# EasyEDA Pro project ProProject_Robot druha verzia_2024-07-18.epro

# Schematic Schematic1

## Sheets
1 MCU core: Create Date: 2024-06-12; Page Name: MCU core; Project Name: Robot druha verzia; Schematic Name: Schematic1; Update Date: 2024-07-14; Company: EasyEDA.com; Drawn: EasyEDA; Page Size: A4; Part Number: JLCPCB-002; Reviewed: EasyEDA; Version: V0.1
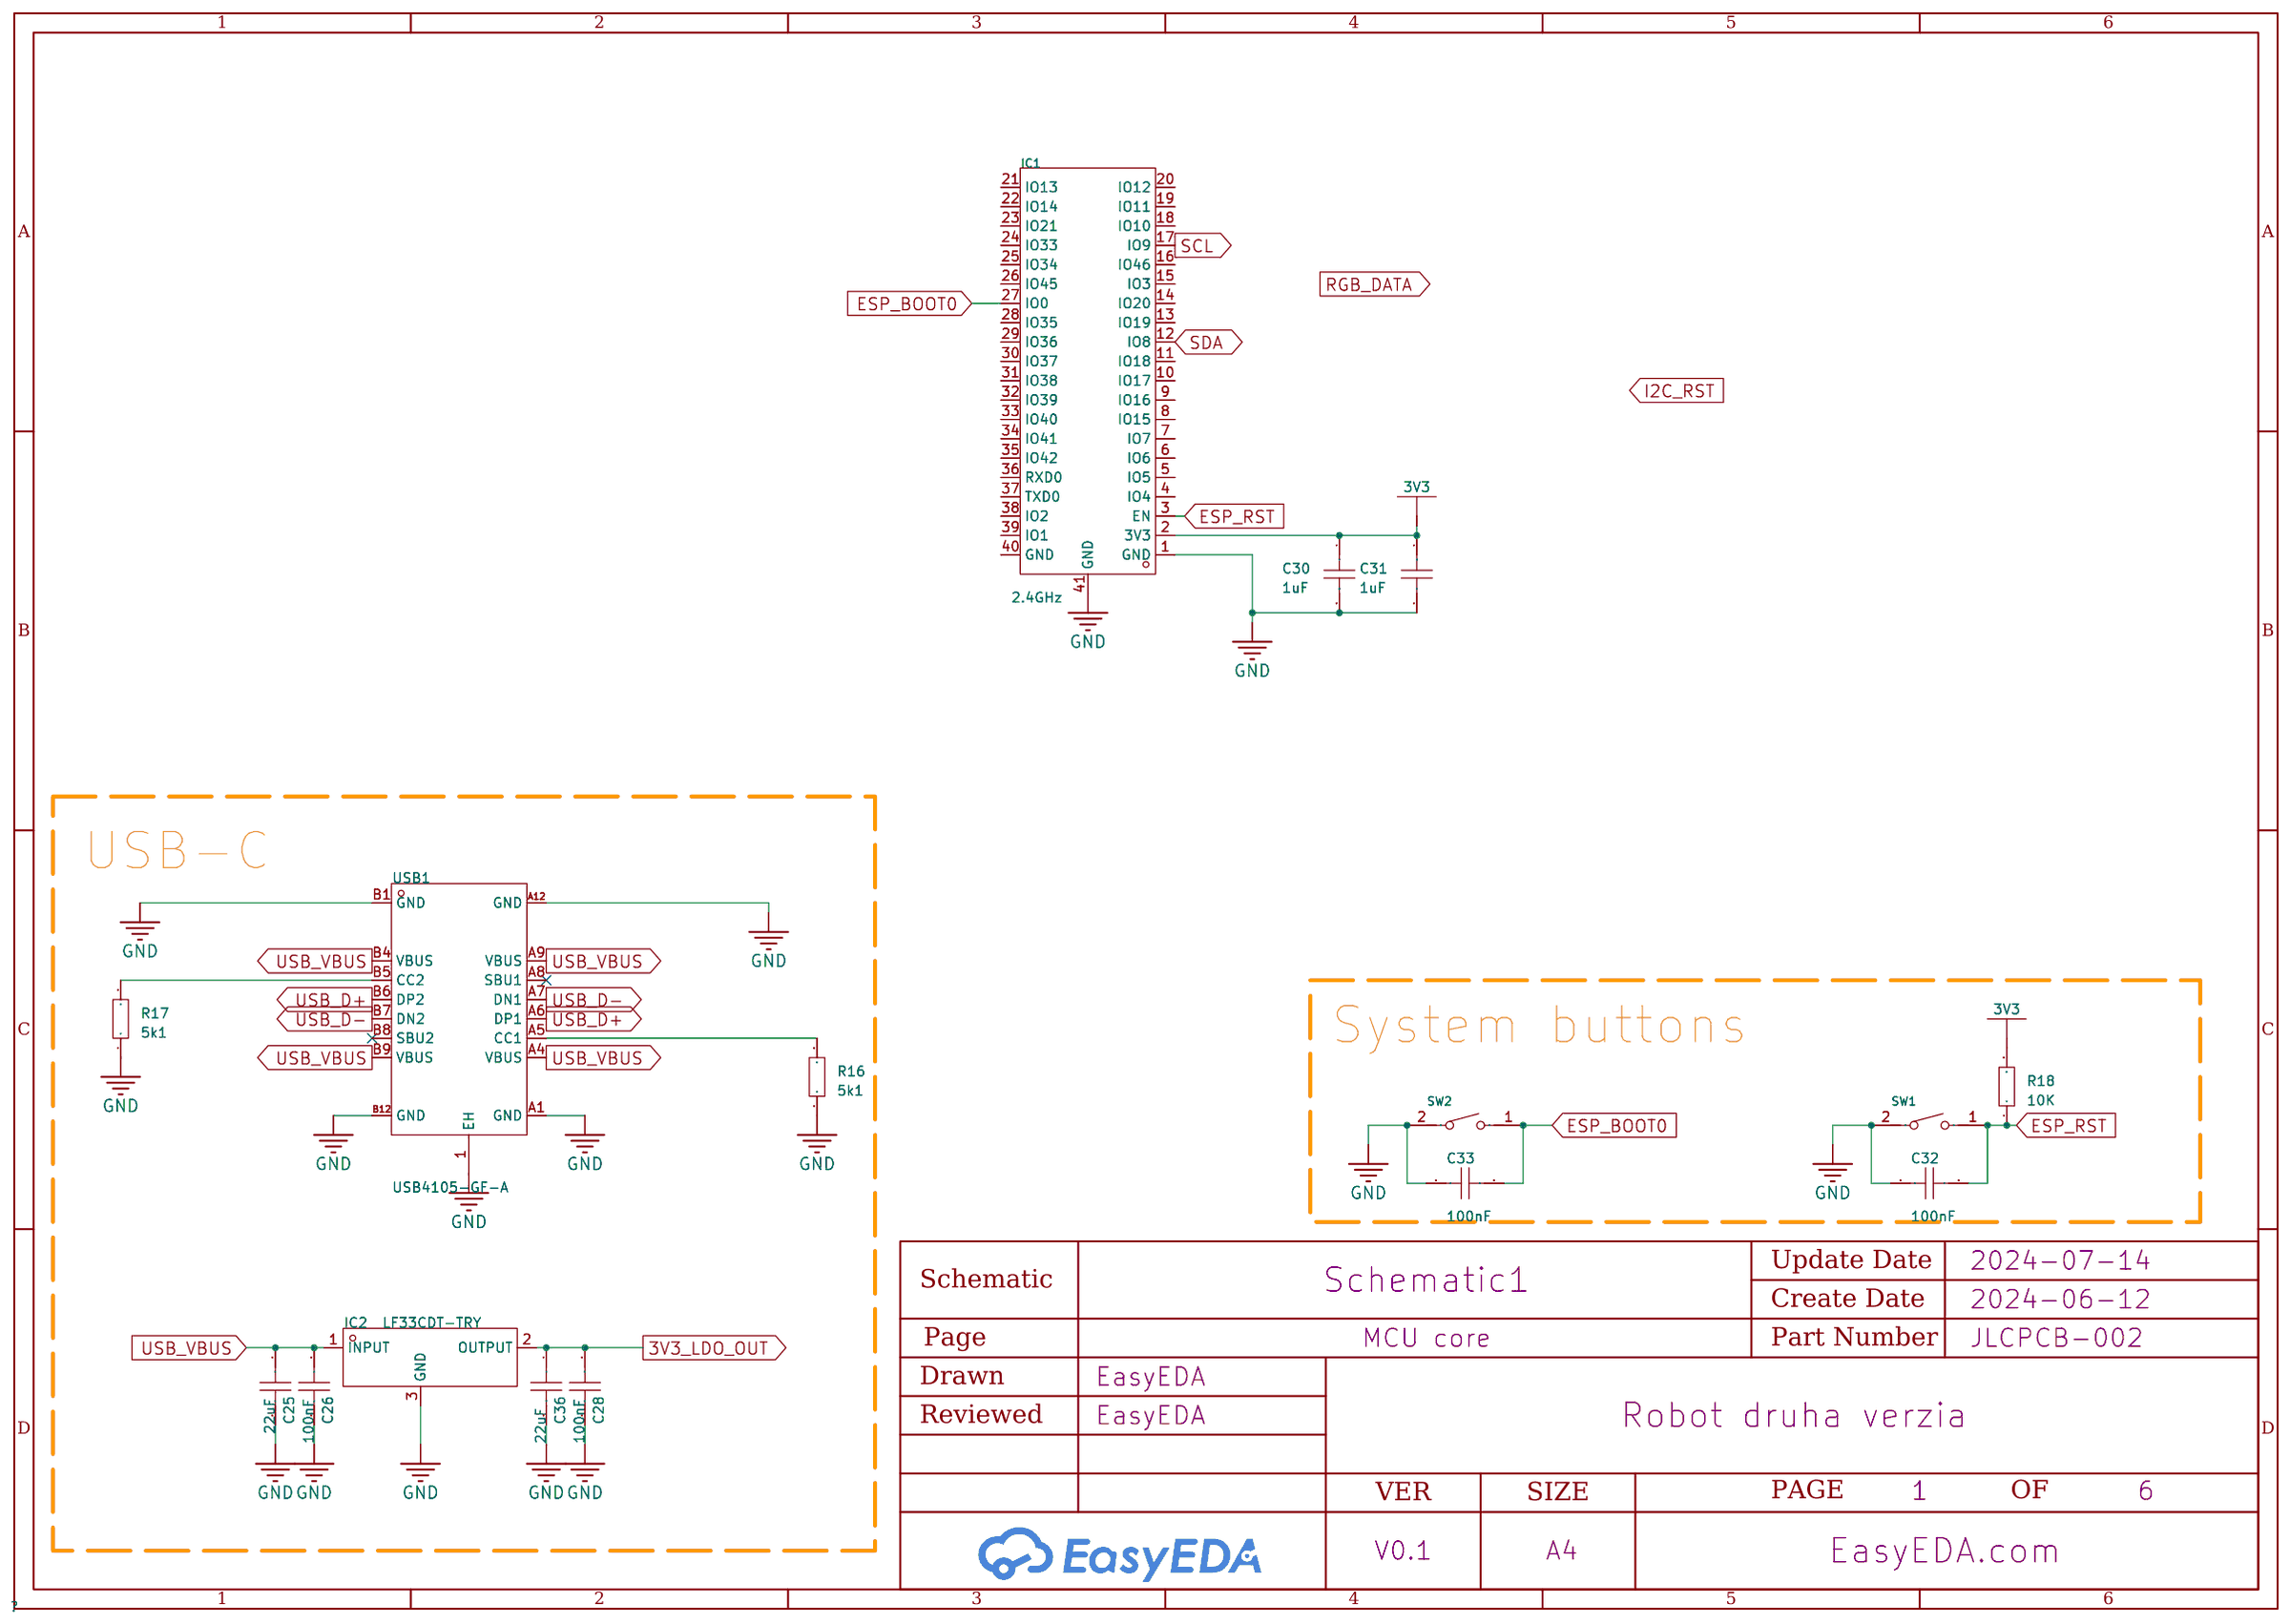
[diagram p0: MCU core]
2 PSU: Create Date: 2024-07-13; Page Name: PSU; Drawn: Marian Harnadek
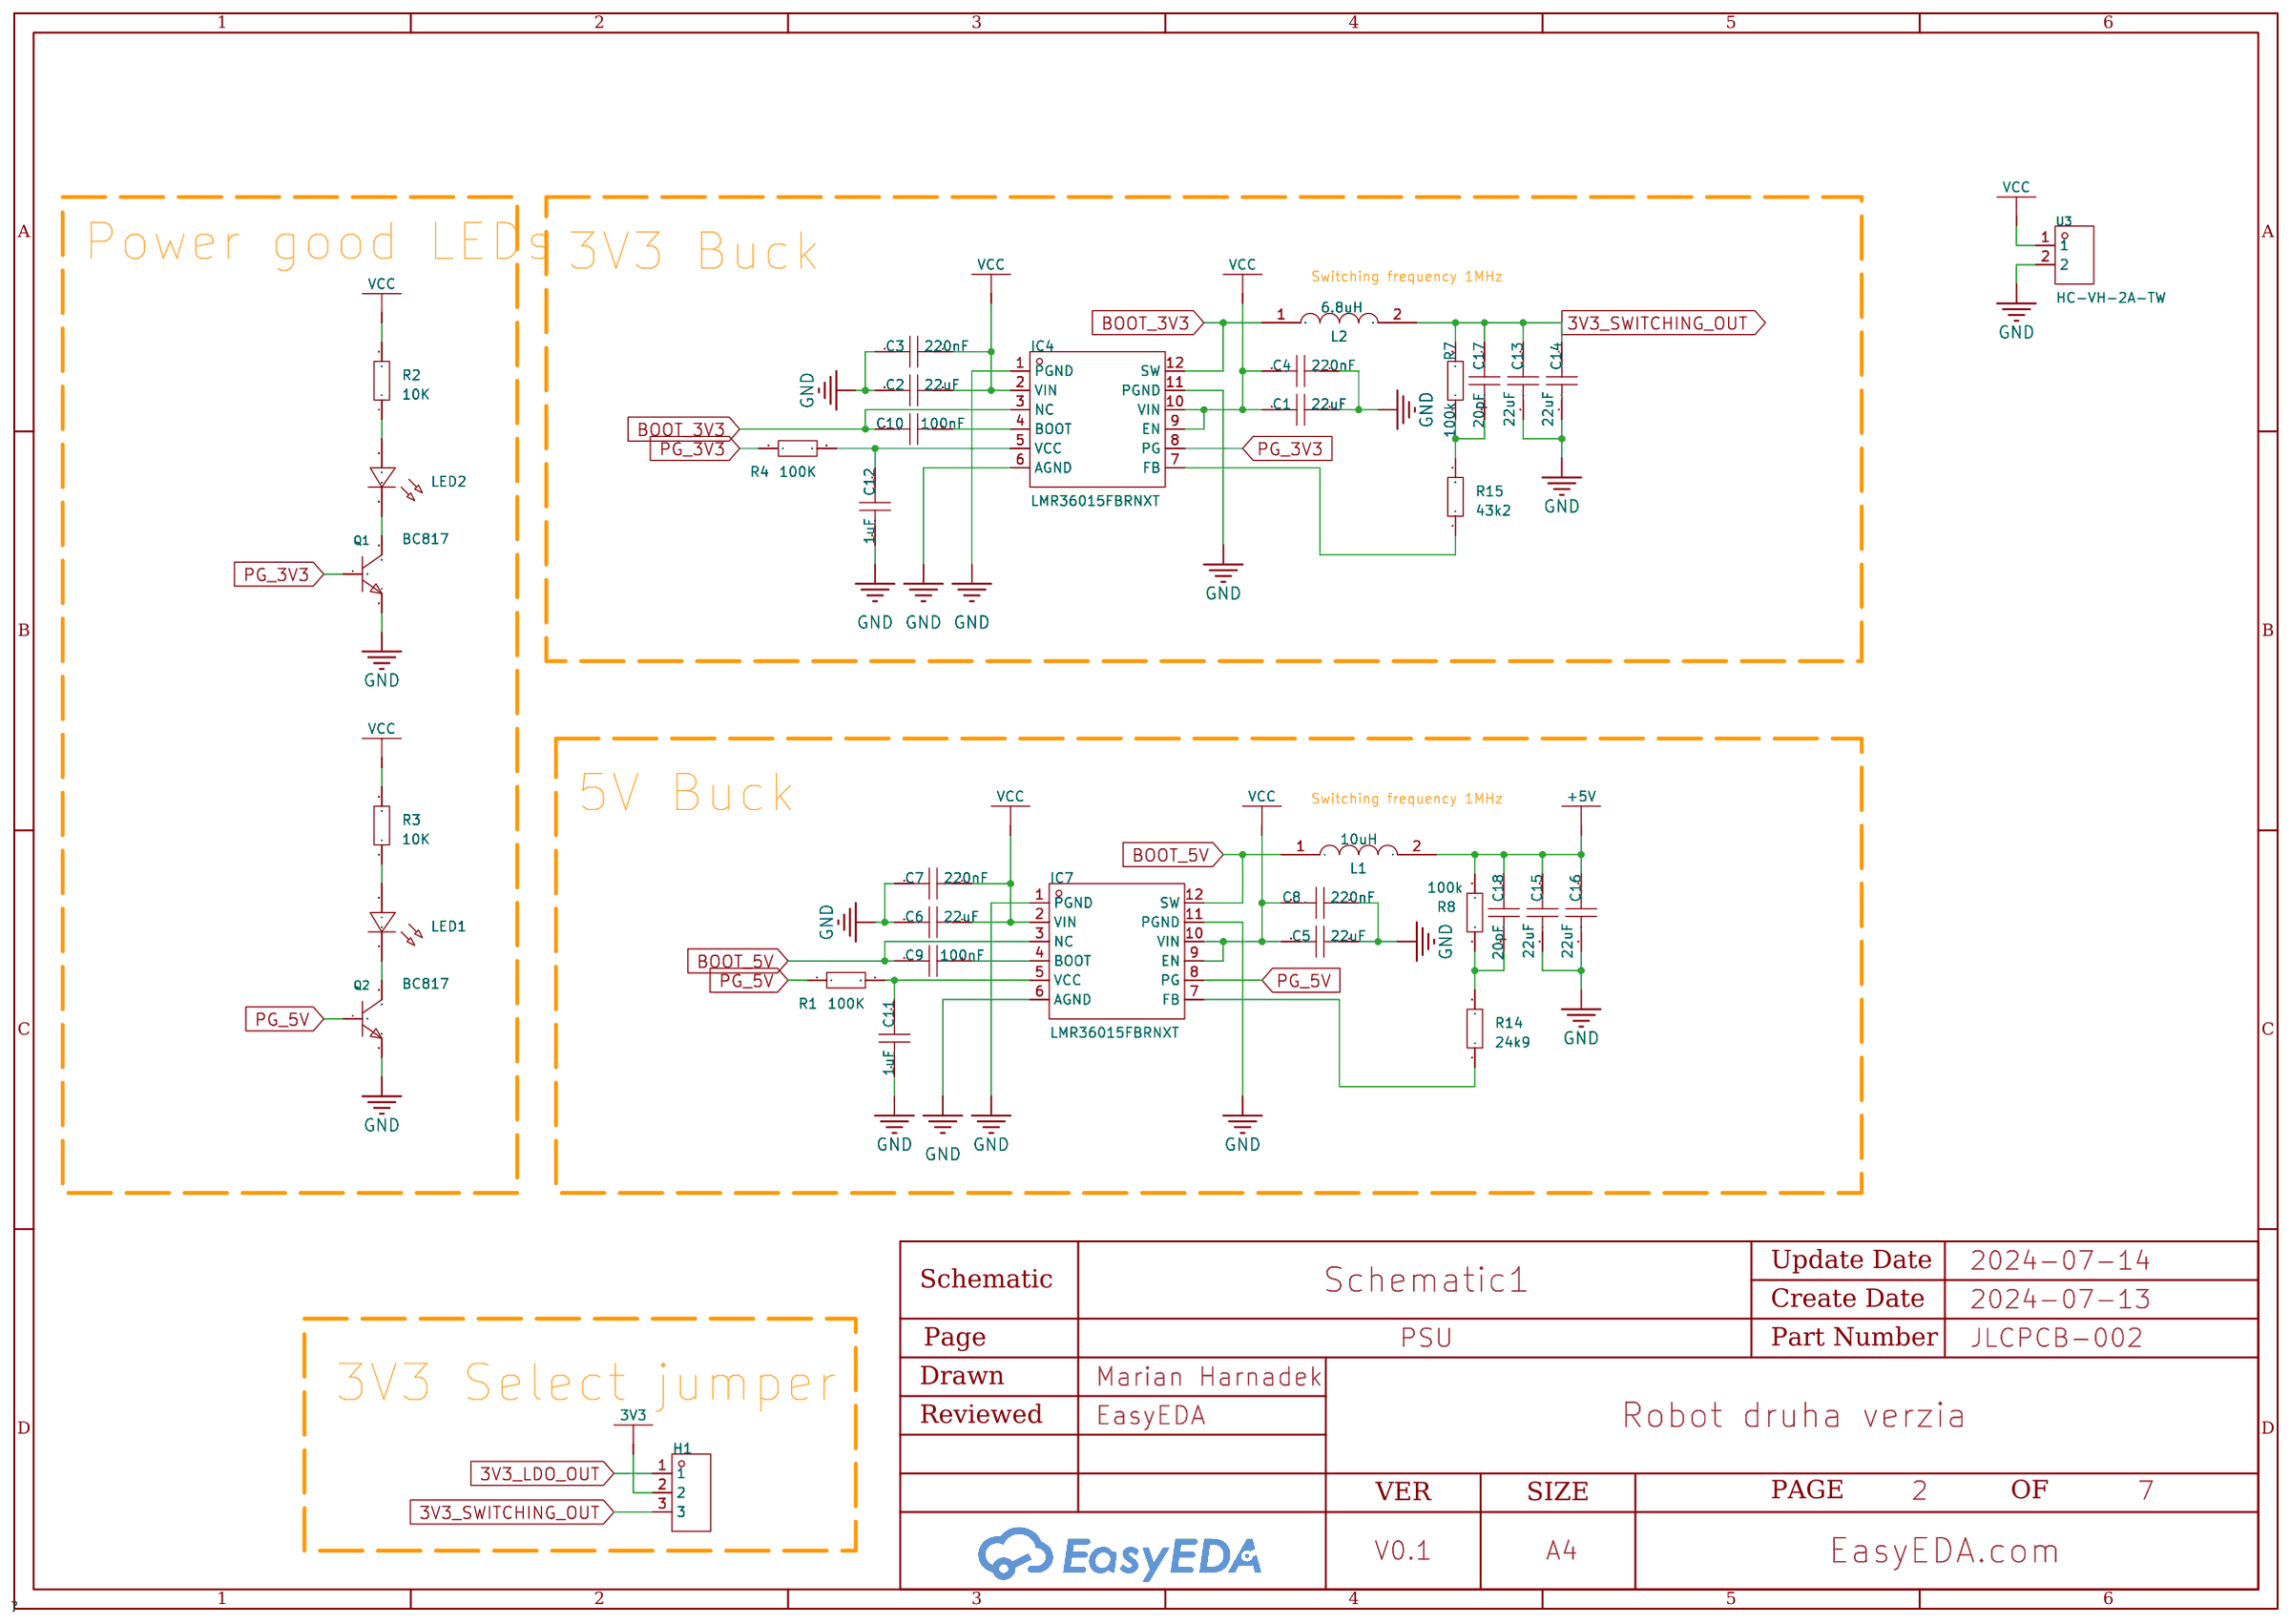
[diagram p1: PSU]
3 Current sense: Create Date: 2024-07-13; Page Name: Current sense; Update Date: 2024-07-13
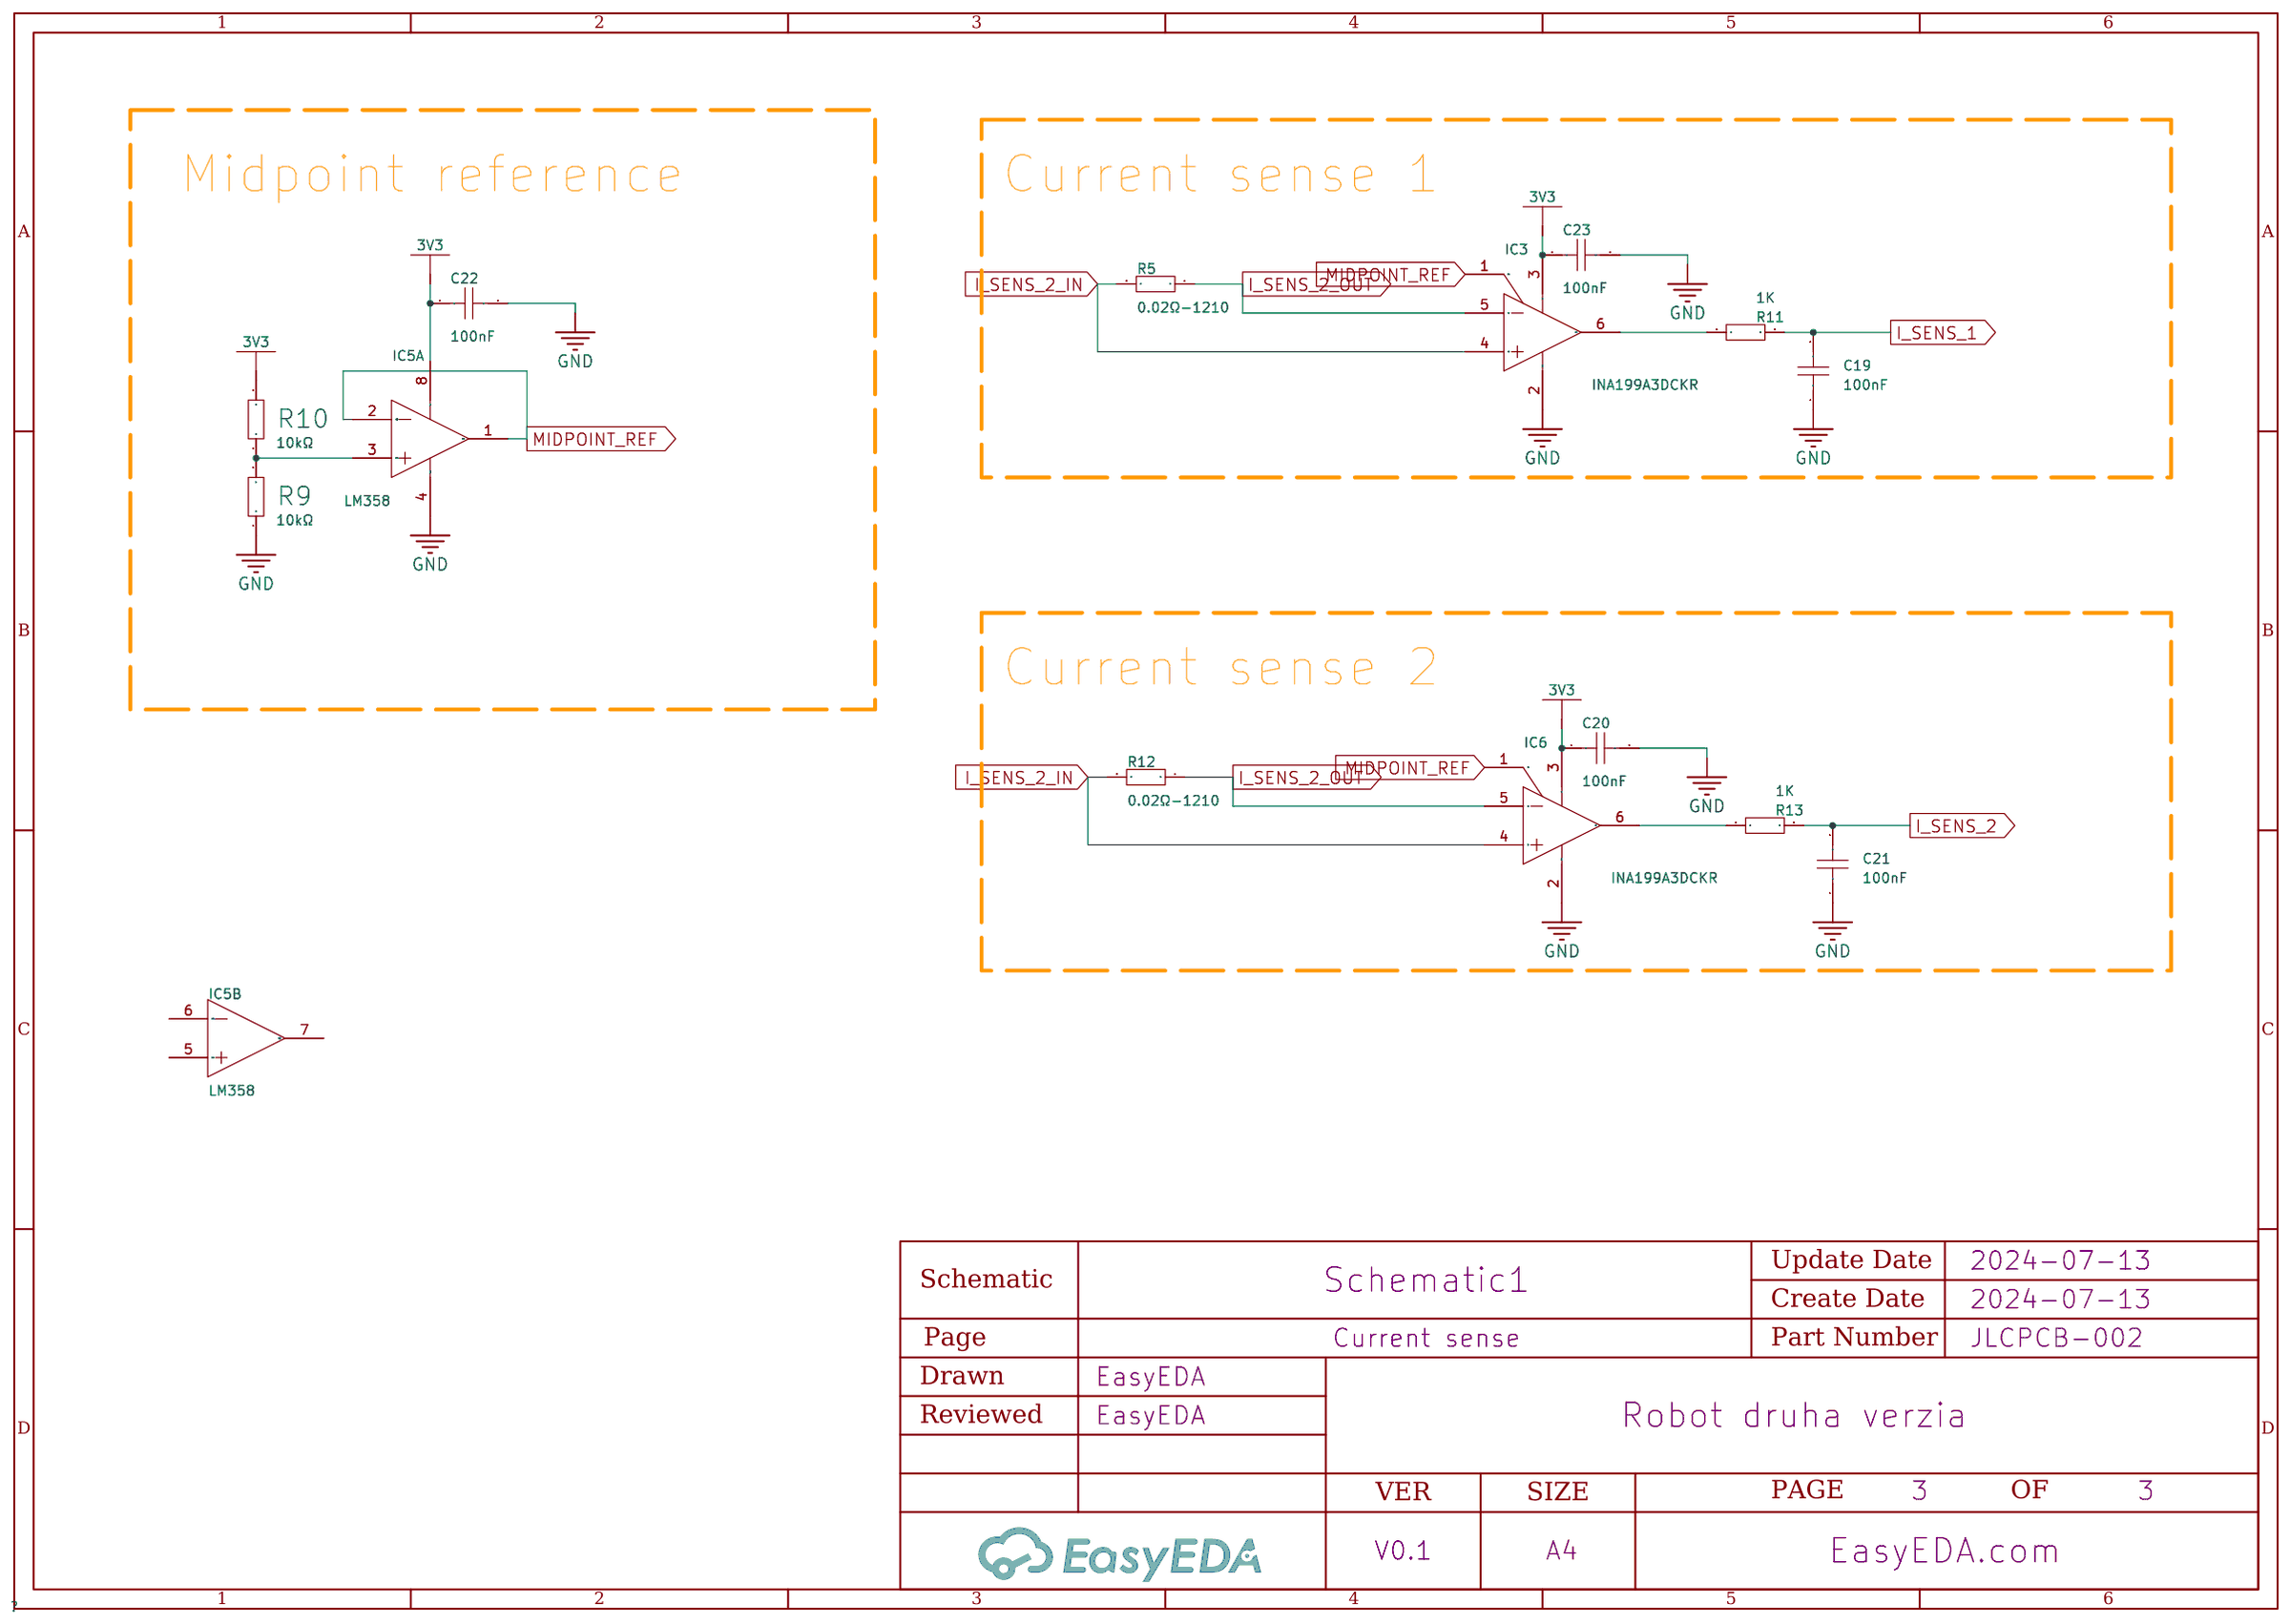
[diagram p2: Current sense]
4 Motor driver: Create Date: 2024-07-13; Page Name: Motor driver
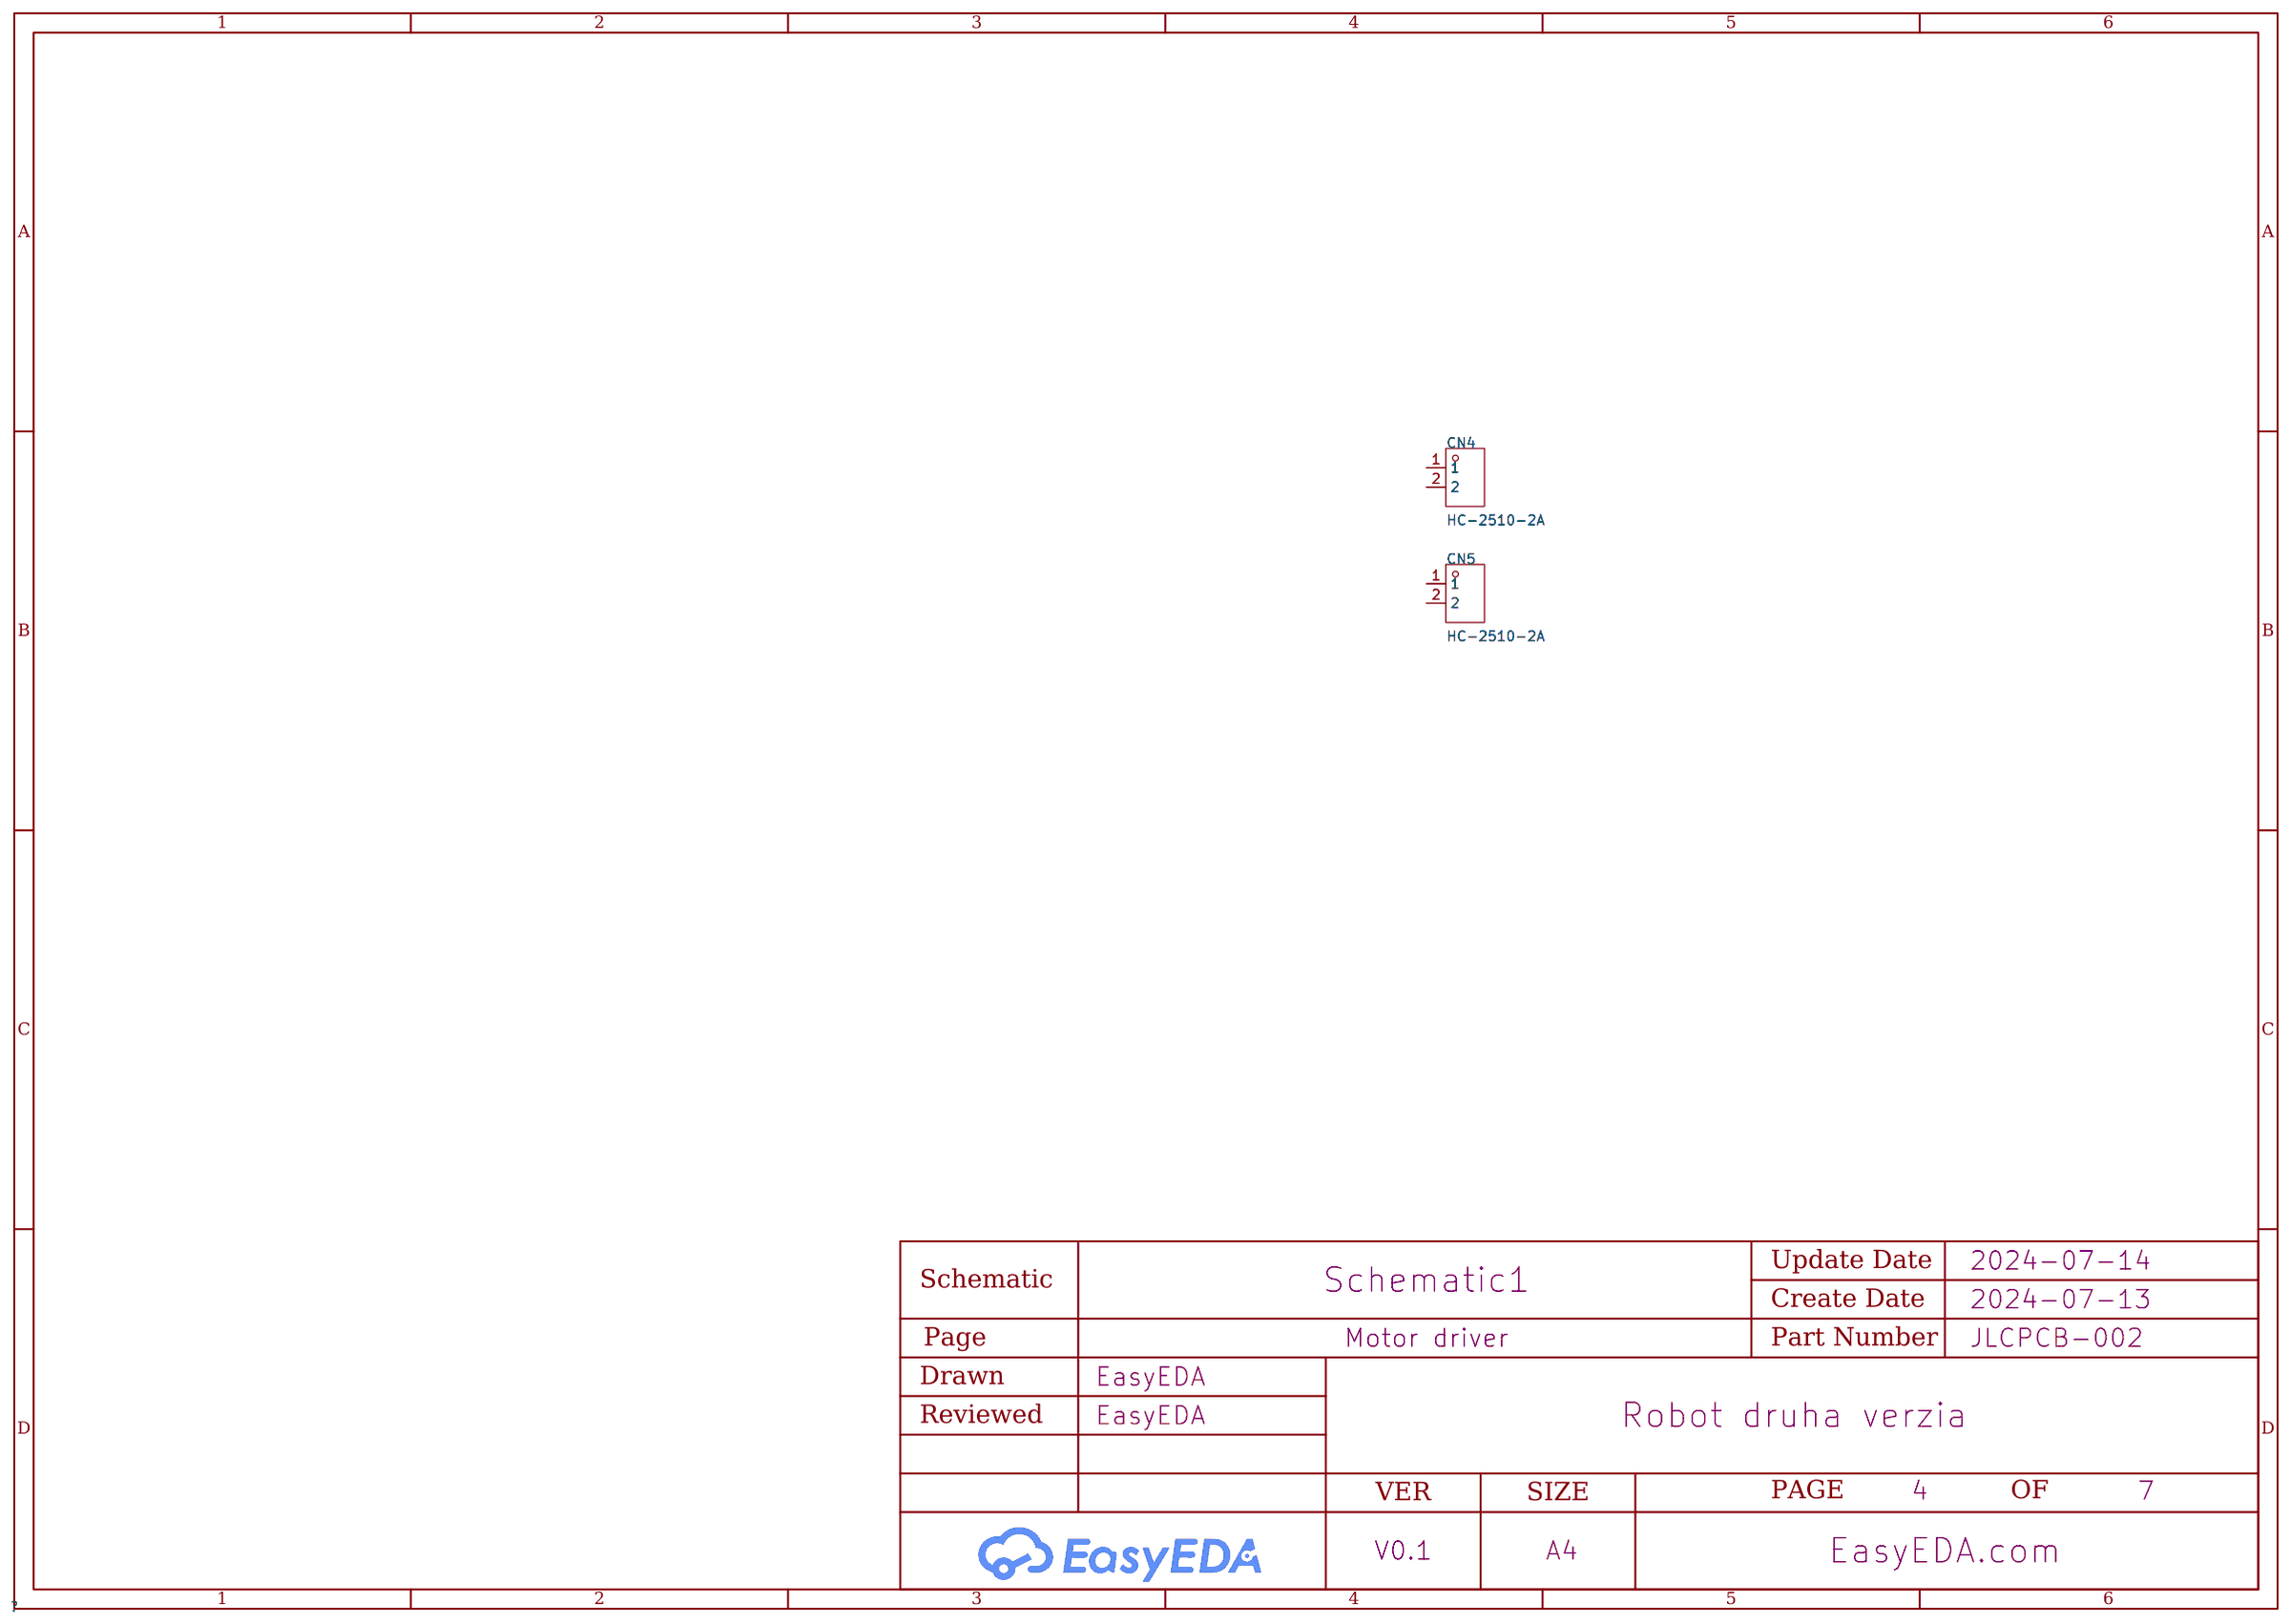
[diagram p3: Motor driver]
5 LGBT lighting: Create Date: 2024-07-13; Page Name: LGBT lighting
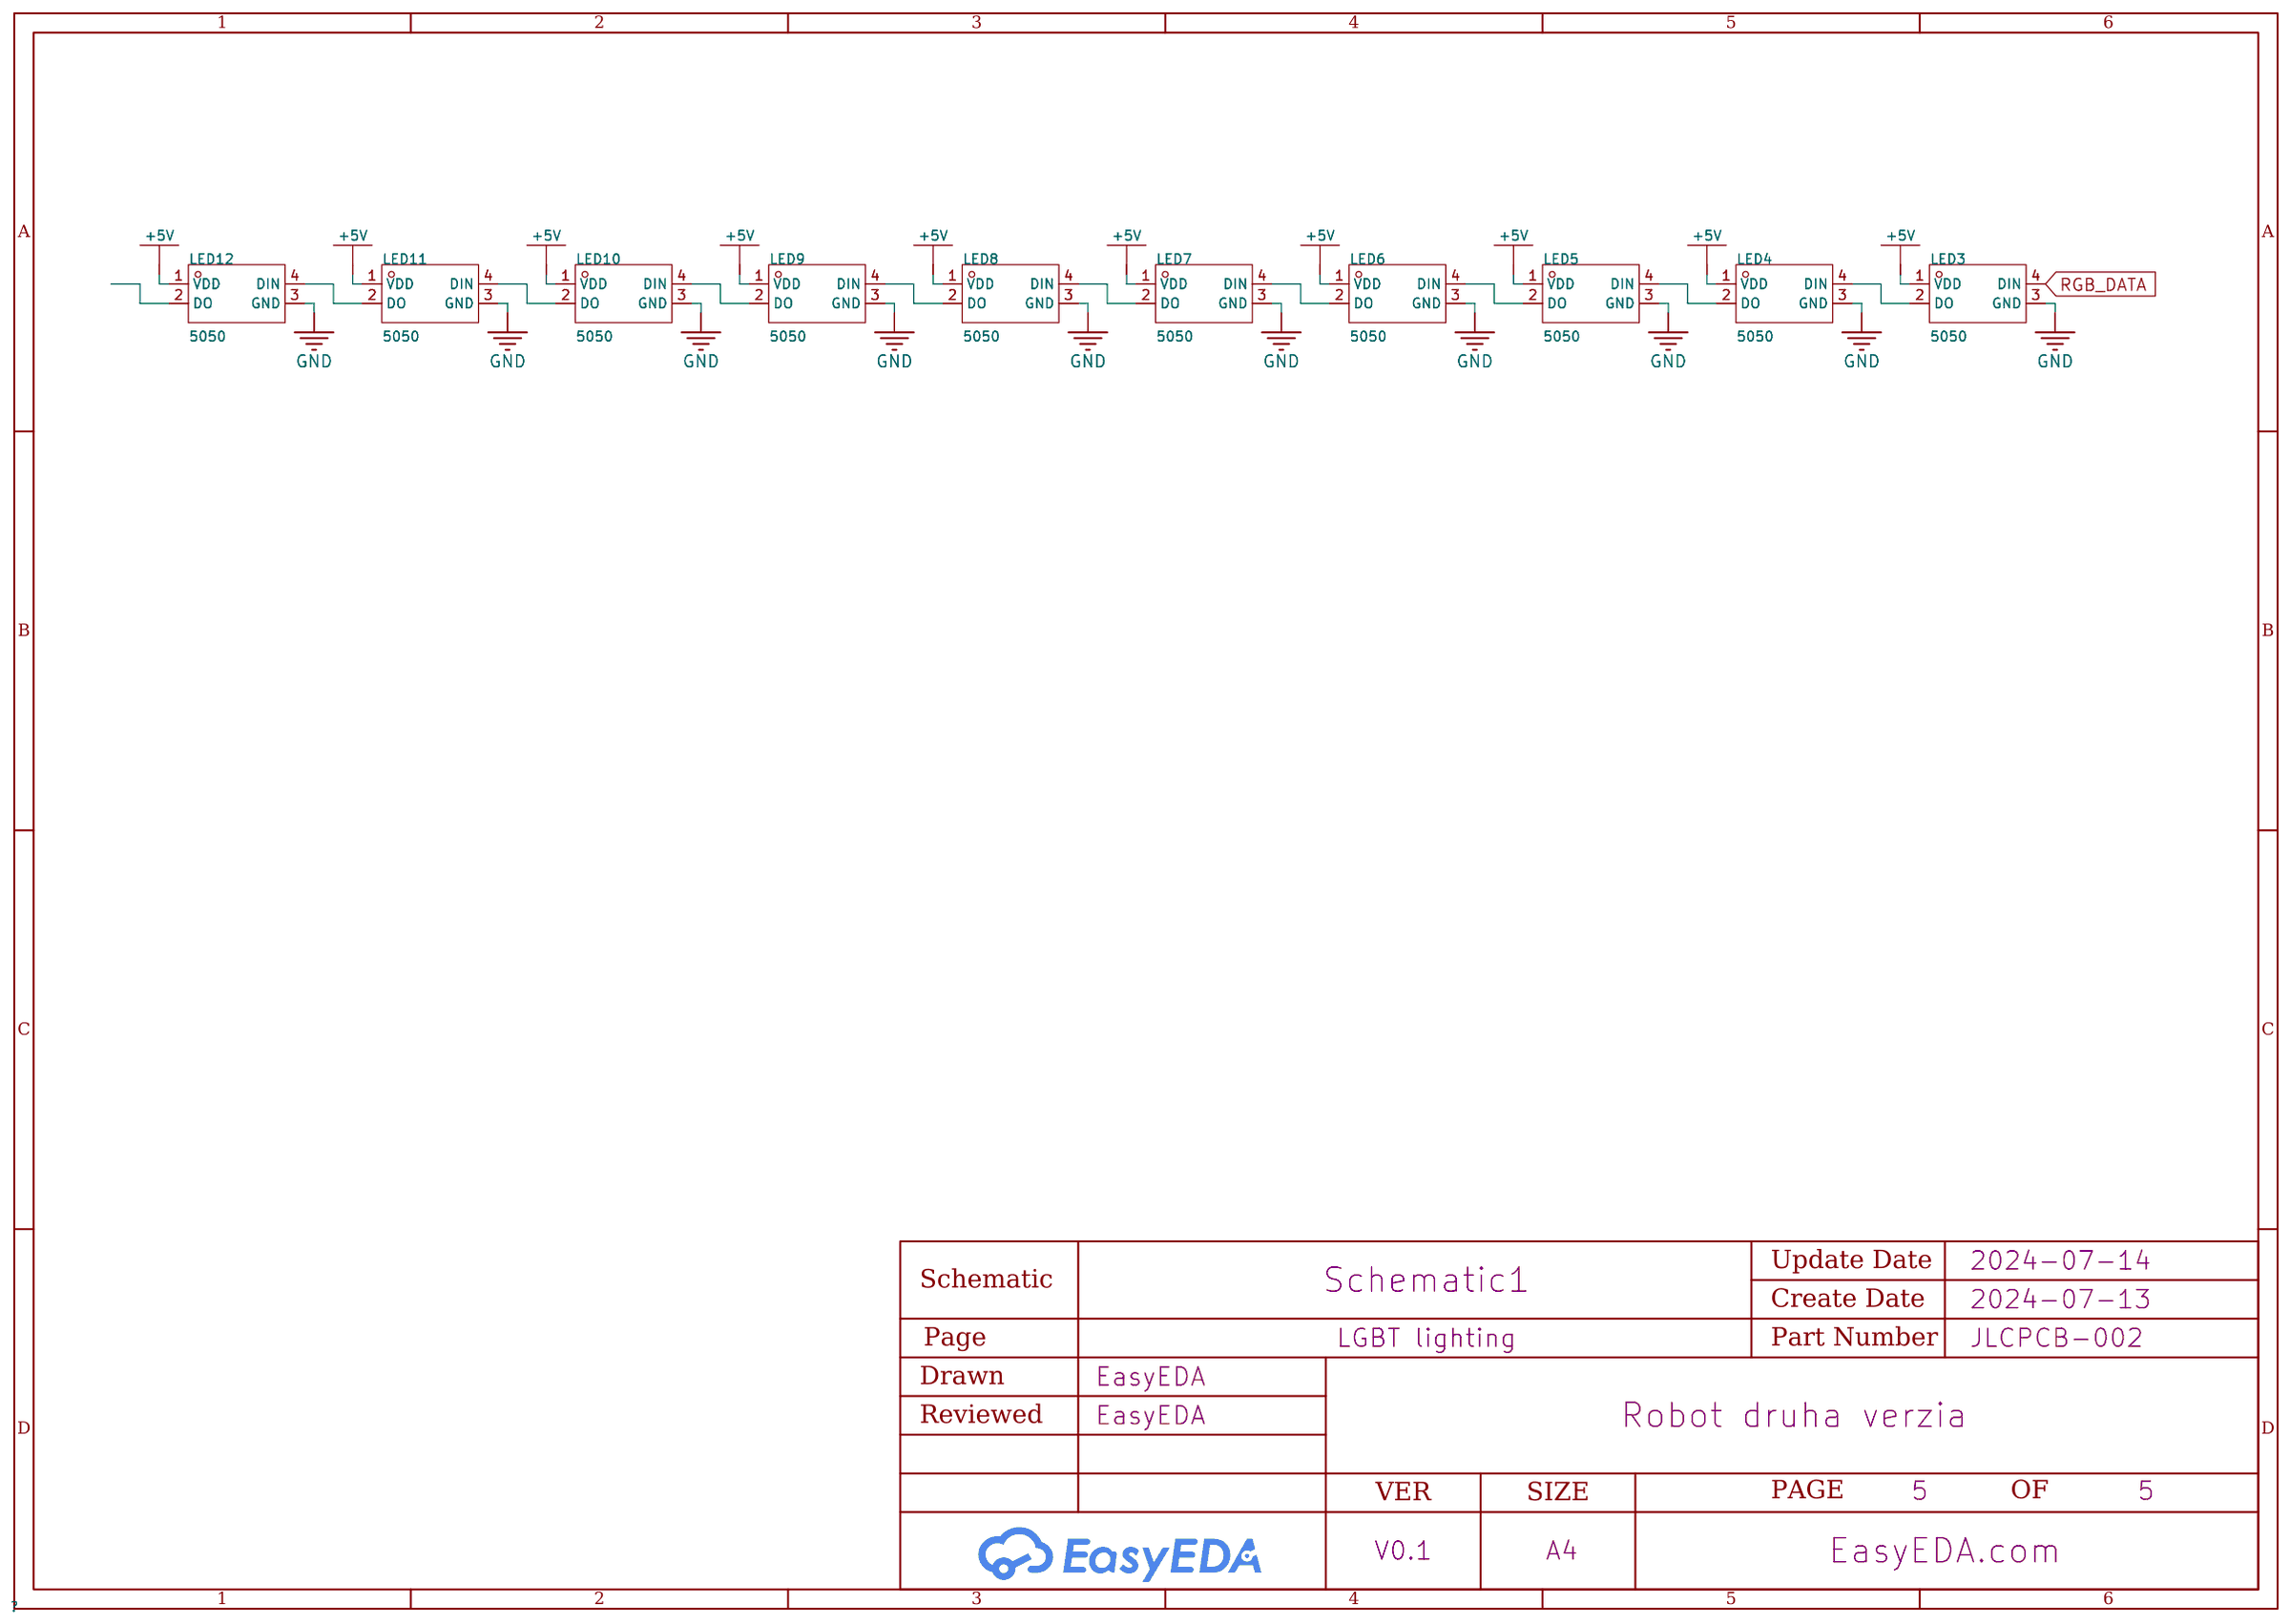
[diagram p4: LGBT lighting]
6 Encoder interface: Create Date: 2024-07-14; Page Name: Encoder interface
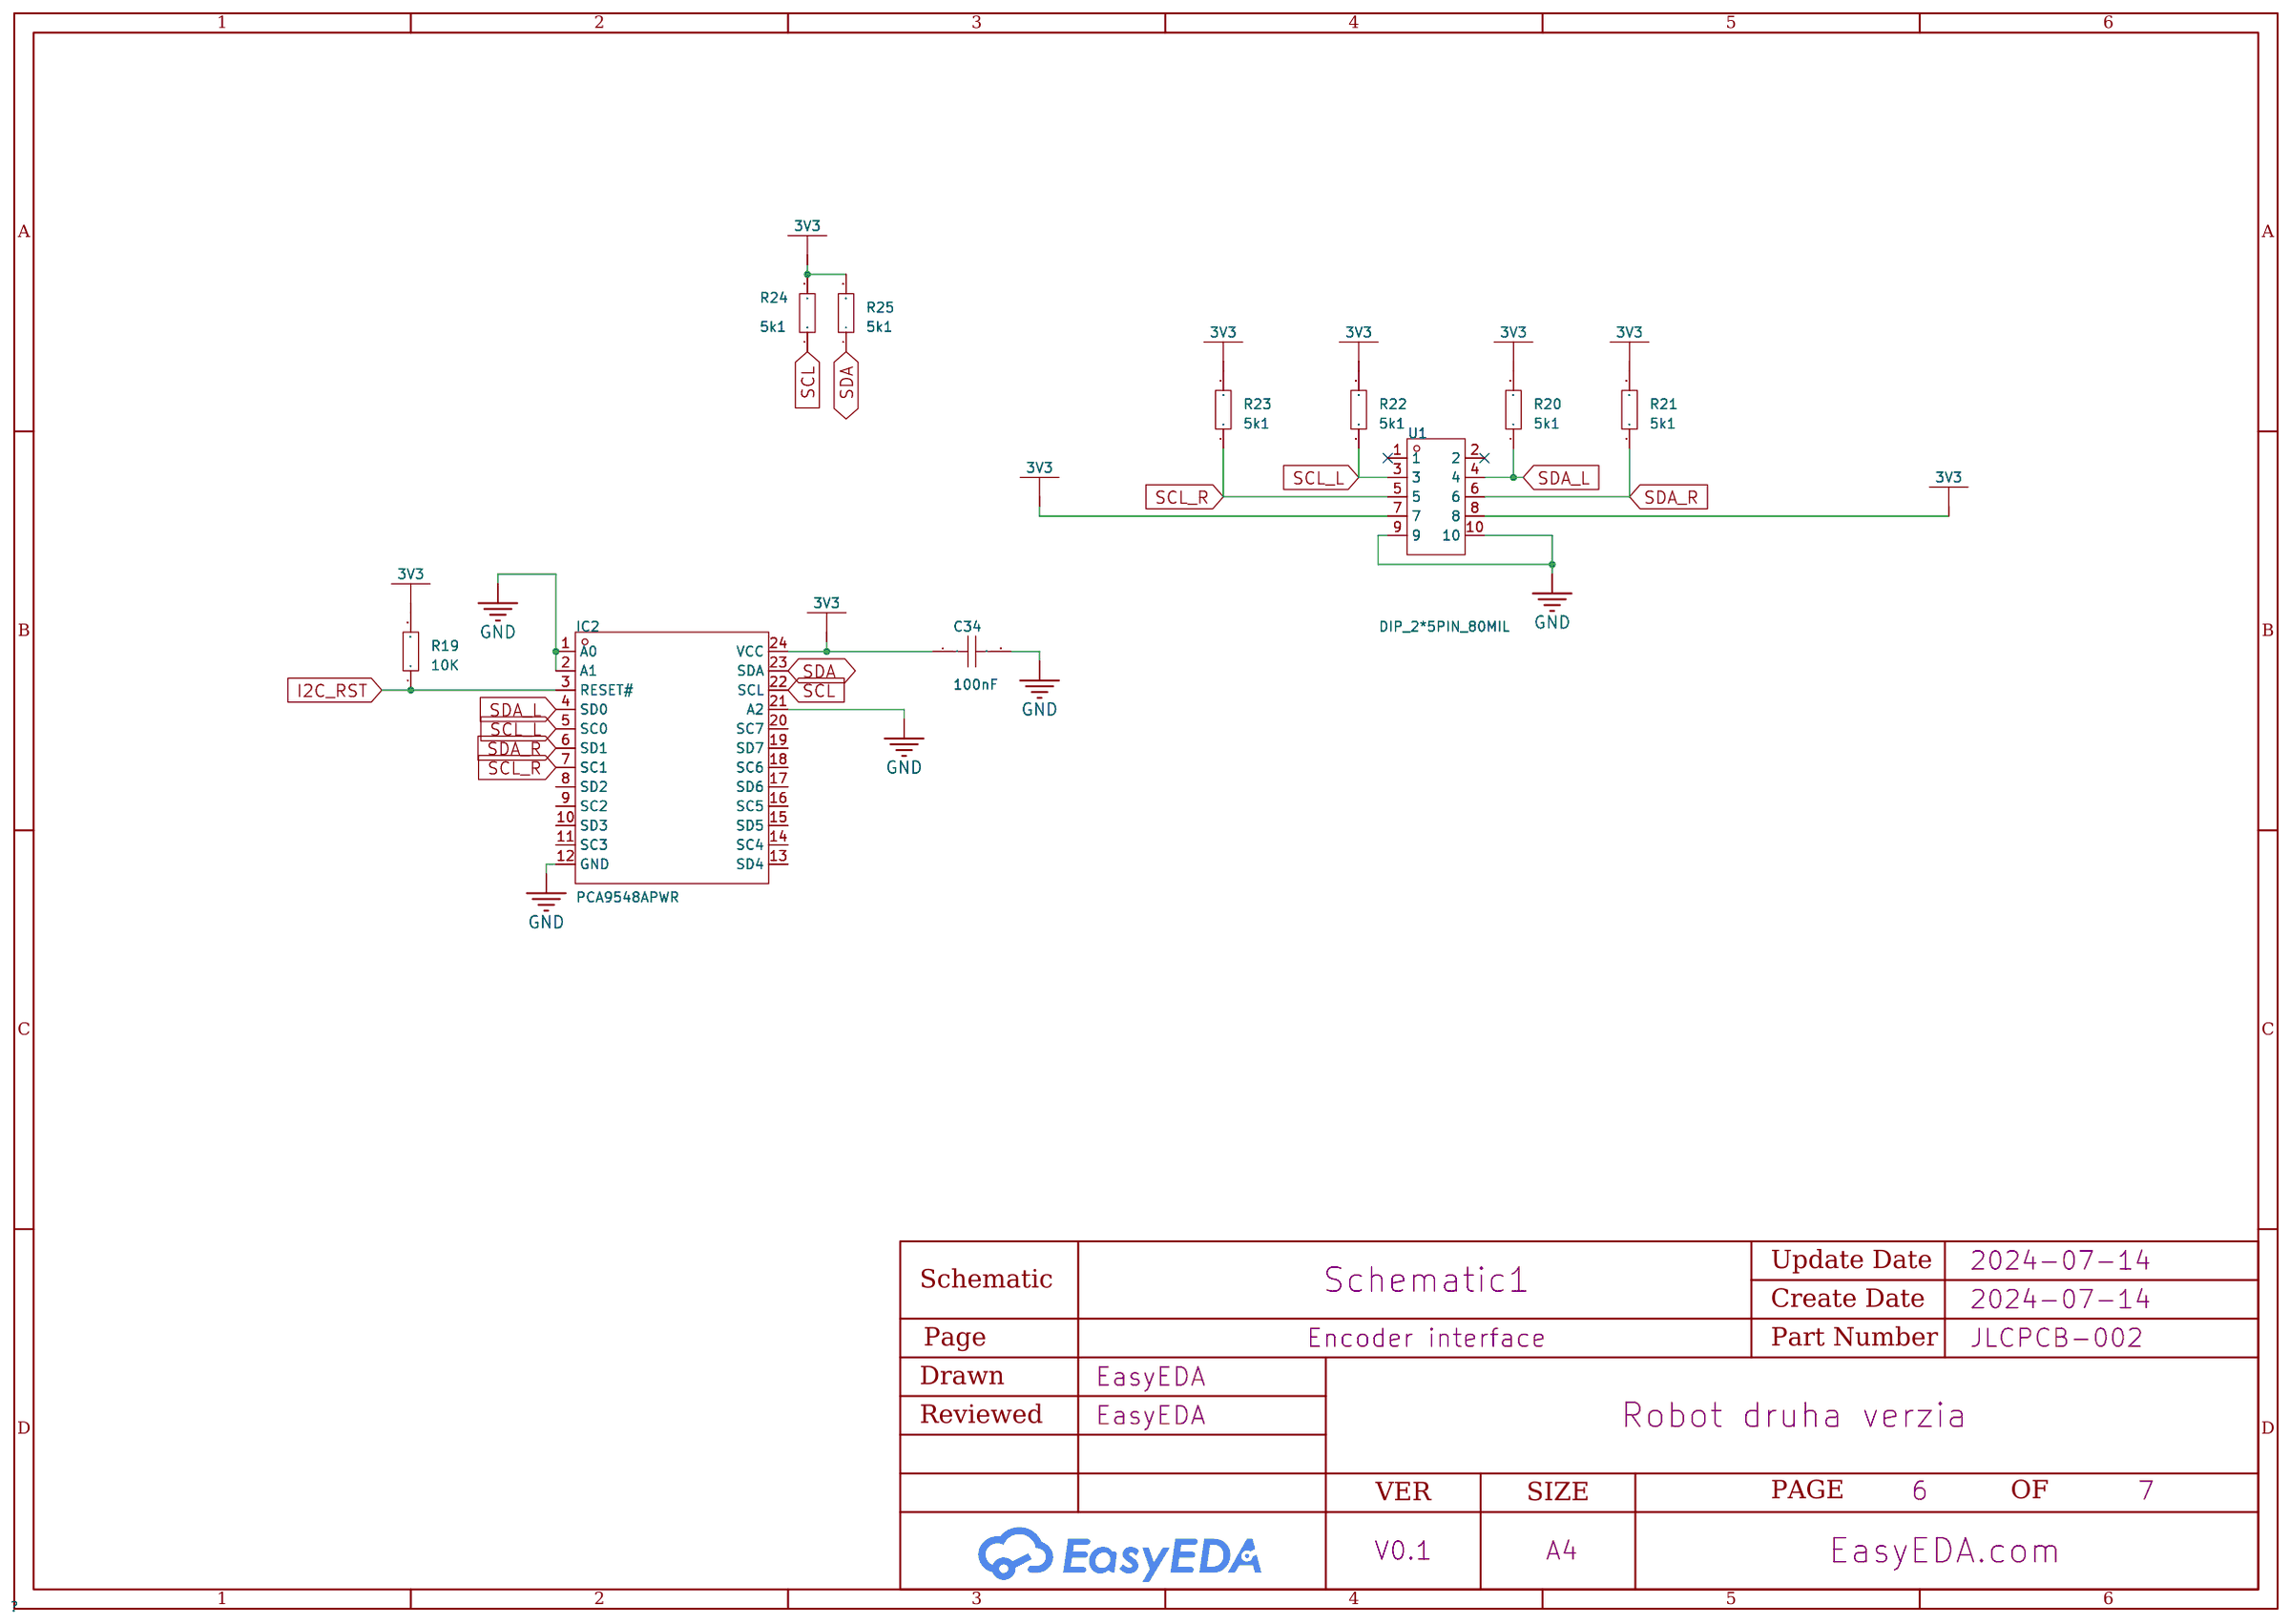
[diagram p5: Encoder interface]
7 Sensor input: Create Date: 2024-07-14; Page Name: Sensor input
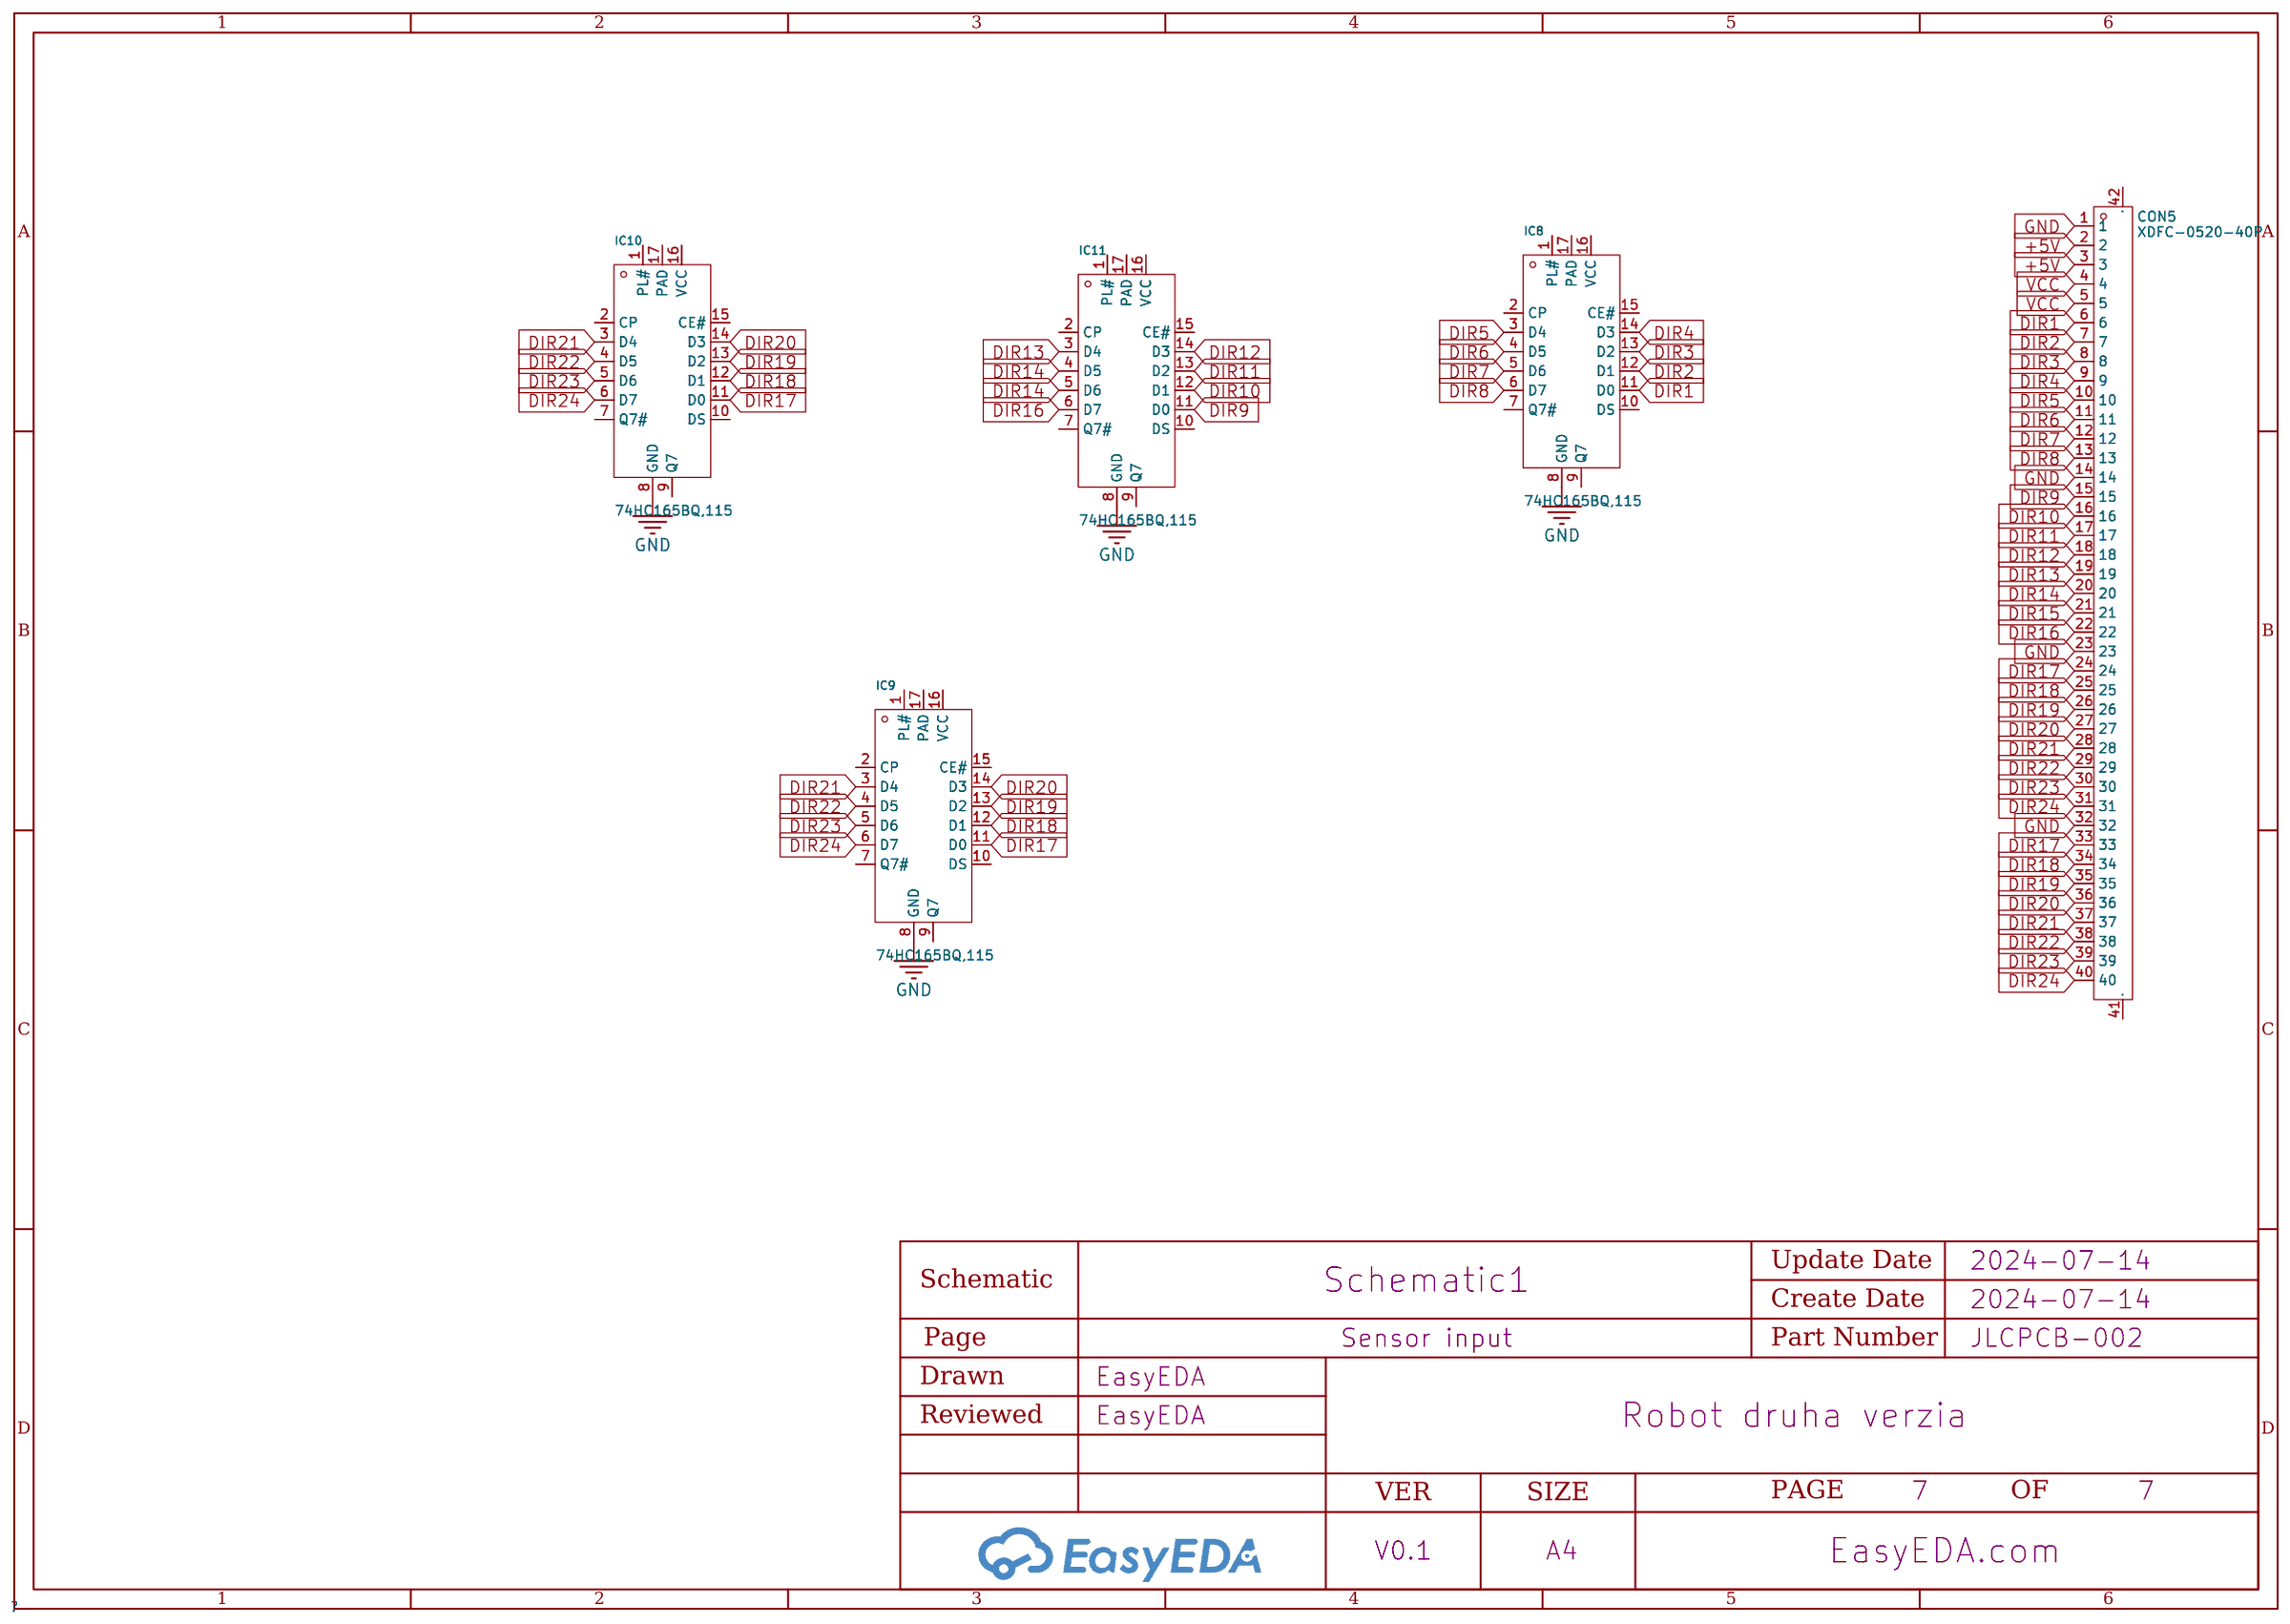
[diagram p6: Sensor input]

## Parts
sheet Current sense
C19  100nF  [C0603]
C20  100nF  [C0603]
C21  100nF  [C0603]
C22  100nF  [C0603]
C23  100nF  [C0603]
IC3  INA199A3DCKR  [SOT-363_L2.0-W1.3-P0.65-LS2.1-BR]
IC5  LM358  [SOP-8_L4.9-W3.9-P1.27-LS6.0-BL]  (sections 1,2)
IC6  INA199A3DCKR  [SOT-363_L2.0-W1.3-P0.65-LS2.1-BR]
R5  0.02Ω-1210  [R1210]
R9  10kΩ  [R0603]
R10  10kΩ  [R0603]
R11  1K  [R0603]
R12  0.02Ω-1210  [R1210]
R13  1K  [R0603]
sheet Encoder interface
C34  100nF  [C0603]
IC2#2  PCA9548APWR  [TSSOP-24_L7.8-W4.4-P0.65-LS6.4-BL]
R19  10K  [R0603]
R20  5k1  [R0603]
R21  5k1  [R0603]
R22  5k1  [R0603]
R23  5k1  [R0603]
R24  5k1  [R0603]
R25  5k1  [R0603]
U1  DIP_2*5PIN_80MIL  [IDC-TH_10P-P2.00_C9900022934]
sheet LGBT lighting
LED3  5050  [LED-SMD_4P-L5.0-W5.0-BL_TC5050RGB]
LED4  5050  [LED-SMD_4P-L5.0-W5.0-BL_TC5050RGB]
LED5  5050  [LED-SMD_4P-L5.0-W5.0-BL_TC5050RGB]
LED6  5050  [LED-SMD_4P-L5.0-W5.0-BL_TC5050RGB]
LED7  5050  [LED-SMD_4P-L5.0-W5.0-BL_TC5050RGB]
LED8  5050  [LED-SMD_4P-L5.0-W5.0-BL_TC5050RGB]
LED9  5050  [LED-SMD_4P-L5.0-W5.0-BL_TC5050RGB]
LED10  5050  [LED-SMD_4P-L5.0-W5.0-BL_TC5050RGB]
LED11  5050  [LED-SMD_4P-L5.0-W5.0-BL_TC5050RGB]
LED12  5050  [LED-SMD_4P-L5.0-W5.0-BL_TC5050RGB]
sheet MCU core
C25  22uF  [C0805]
C26  100nF  [C0603]
C28  100nF  [C0603]
C30  1uF  [C0603]
C31  1uF  [C0603]
C32  100nF  [C0603]
C33  100nF  [C0603]
C36  22uF  [C0805]
IC1  2.4GHz  [WIRELM-SMD_ESP32-S3-WROOM-1]
IC2  LF33CDT-TRY  [TO-252-3_L6.6-W6.1-P4.56-LS9.9-TL]
R16  5k1  [R0603]
R17  5k1  [R0603]
R18  10K  [R0603]
SW1  TS3625A-HT  [SW-SMD_L6.1-W3.7-LS7.9]
SW2  TS3625A-HT  [SW-SMD_L6.1-W3.7-LS7.9]
USB1  USB4105-GF-A  [TYPE-C-SMD_SBC-160S1A-20-S412]
sheet Motor driver
CN4  HC-2510-2A  [CONN-TH_2P-P2.54_HCTL_HC-2510-2A]
CN5  HC-2510-2A  [CONN-TH_2P-P2.54_HCTL_HC-2510-2A]
sheet PSU
C1  22uF  [C0805]
C2  22uF  [C0805]
C3  220nF  [C0603]
C4  220nF  [C0603]
C5  22uF  [C0805]
C6  22uF  [C0805]
C7  220nF  [C0603]
C8  220nF  [C0603]
C9  100nF  [C0603]
C10  100nF  [C0603]
C11  1uF  [C0603]
C12  1uF  [C0603]
C13  22uF  [C0805]
C14  22uF  [C0805]
C15  22uF  [C0805]
C16  22uF  [C0805]
C17  20pF  [C0603]
C18  20pF  [C0603]
H1  -  [HDR-TH_3P-P2.54-V-M]
IC4  LMR36015FBRNXT  [VQFN-12_L3.0-W2.0-P0.65-BL_TI_RNX]
IC7  LMR36015FBRNXT  [VQFN-12_L3.0-W2.0-P0.65-BL_TI_RNX]
L1  10uH  [XAL7030103MEC]
L2  6.8uH  [INDPM5552X200N]
LED1  -  [LED0603-RD_GREEN]
LED2  -  [LED0603-RD_GREEN]
Q1  BC817  [SOT-23-3_L2.9-W1.4-P1.91-LS2.6-BR]
Q2  BC817  [SOT-23-3_L2.9-W1.4-P1.91-LS2.6-BR]
R1  100K  [R0603]
R2  10K  [R0603]
R3  10K  [R0603]
R4  100K  [R0603]
R7  100k  [R0603]
R8  100k  [R0603]
R14  24k9  [R0603]
R15  43k2  [R0603]
U3  HC-VH-2A-TW  [CONN-TH_2P-P3.96_HC-VH-2A-TW]
sheet Sensor input
CON5  XDFC-0520-40P  [conn-smd_40p-p0.50_f31l-1a7h1-21040]
IC8  74HC165BQ,115  [DHVQFN-16_L3.5-W2.5-P0.50-BL-EP]
IC9  74HC165BQ,115  [DHVQFN-16_L3.5-W2.5-P0.50-BL-EP]
IC10  74HC165BQ,115  [DHVQFN-16_L3.5-W2.5-P0.50-BL-EP]
IC11  74HC165BQ,115  [DHVQFN-16_L3.5-W2.5-P0.50-BL-EP]

## Library data of the parts
C3 C4 C7-C12 C17-C23 C26 C28 C30-C34 = CAP_0603: Supplier Footprint: 0603
IC3 IC6 = INA199A3DCKR: Supply Voltage:-300mV~26V Supply Voltage:-300mV~26V Supply Current:1.1uA Operating Temperature:-40℃~+125℃ Operating Temperature:-40℃~+125℃; Supplier Part: C132098; Manufacturer: TI(德州仪器); Supplier Footprint: SOT-363-6; JLCPCB Part Class: Extended Part; Datasheet: https://www.ti.com/cn/lit/gpn/ina199; Supplier: LCSC; Supply Voltage: -300mV~26V; Supply Current: 1.1uA; Operating Temperature: -40℃~+125℃
IC5 = LM358: Supplier Part: C2984960; Manufacturer: HX(恒佳兴); Supplier Footprint: SOP-8; JLCPCB Part Class: Extended Part; Datasheet: https://atta.szlcsc.com/upload/public/pdf/source/20220411/BF8A74874B47C6BB2B58E6B995D1DE82.pdf; Supplier: LCSC
R5 R12 = 0Ω-1210: Supplier Part: C9900009415; Supplier: LCSC
R9 R10 = 0603WAF1002T5E: Type:Thick Film Resistors Resistance:10kΩ Tolerance:±1% Tolerance:±1% Power(Watts): Overload Voltage (Max): Temperature Coefficient:±100ppm/℃ Temperature Coefficient:±100ppm/℃ Operating Temperature Range:-55℃~+155℃ Operating Temperature Range:-55℃~+155℃; LCSC Part Name: 厚膜电阻 10kΩ ±1% 100mW; Supplier Part: C25804; Manufacturer: UNI-ROYAL(厚声); Supplier Footprint: 0603; JLCPCB Part Class: Basic Part; Datasheet: https://atta.szlcsc.com/upload/public/pdf/source/20200306/C422600_1E6D84923E4A46A82E41ADD87F860B5C.pdf; Supplier: LCSC; Type: Thick Film Resistors; Tolerance: ±1%; Temperature Coefficient: ±100ppm/℃; Operating Temperature Range: -55℃~+155℃
R1-R4 R7 R8 R11 R13-R25 = Res_0603: Supplier Footprint: 0603
IC2#2 = PCA9548APWR: Supplier Part: C295762; Manufacturer: TI(德州仪器); Supplier Footprint: TSSOP-24; JLCPCB Part Class: Extended Part; Datasheet: https://www.ti.com/cn/lit/gpn/pca9548a; Supplier: LCSC
U1 = DIP_2*5PIN_80MIL: Supplier Part: C9900022934; Supplier Footprint: IDC-TH_10P-P2.00; Supplier: LCSC
LED3-LED12 = 5050: Supplier Part: C9900018310; Supplier Footprint: LED-SMD_4P; Supplier: LCSC
C1 C2 C5 C6 C13-C16 C25 C36 = CAP_0805: Supplier Footprint: 0805
IC1 = ESP32-S2-SOLO-2-N4: Core Processor:ESP32-S2芯片 Support Interface:I2C；GPIO；SPI；PWM；ADC；UART；USB；I2S Frequency:2.4GHz Output Power:19.5dBm Output Power:19.5dBm; Supplier Part: C3040594; Manufacturer: ESPRESSIF(乐鑫); Supplier Footprint: SMD-41P; JLCPCB Part Class: Extended Part; Datasheet: https://atta.szlcsc.com/upload/public/pdf/source/20220829/68E69EF550BFD22B9418B9E05FF4E453.pdf; Supplier: LCSC; Core Processor: ESP32-S2芯片; Support Interface: I2C；GPIO；SPI；PWM；ADC；UART；USB；I2S; Output Power: 19.5dBm
IC2 = LF33CDT-TRY: Output Type:固定 Maximum Input Voltage:16V Output Voltage:3.3V Output Voltage:3.3V MAX Output Current:500mA Dropout Voltage:1.3V@(500mA) standby current:2mA Operating Temperature:-40℃~+125℃ Operating Temperature:-40℃~+125℃ Output Polarity:Positive electrode; Supplier Part: C2970332; Manufacturer: ST(意法半导体); Supplier Footprint: DPAK; Datasheet: https://atta.szlcsc.com/upload/public/pdf/source/20191009/C435902_65B3AAB3204119845CFC8A7586266A6B.pdf; Supplier: LCSC; Output Type: 固定; Maximum Input Voltage: 16V; Output Voltage: 3.3V; MAX Output Current: 500mA; Dropout Voltage: 1.3V@(500mA); standby current: 2mA; Operating Temperature: -40℃~+125℃; Output Polarity: Positive electrode; Number of Outputs: 1
SW1 SW2 = TS3625A-HT: Circuit:SPST Actuator Style:Rectangle button Operating Force:250gf Mounting Style:Brick nogging Switch Length:6.1mm Switch Width:3.65mm Switch Height:2.5mm Contact Current:50mA Voltage Rating (DC):36V With Lamp:- Mechanical Life:-; LCSC Part Name: 6.1*3.65*2.5mm 立贴 轻触开关; Supplier Part: C412368; Manufacturer: SHOU HAN(首韩); Supplier Footprint: SMD,3.7x6.1mm; JLCPCB Part Class: Extended Part; Datasheet: https://atta.szlcsc.com/upload/public/pdf/source/20190816/C412368_ED995B38C5F41C525244887EA1991E6A.pdf; Supplier: LCSC; Circuit: SPST; Actuator Style: Rectangle button; Operating Force: 250gf; Mounting Style: Brick nogging; Switch Length: 6.1mm; Switch Width: 3.65mm; Switch Height: 2.5mm; Contact Current: 50mA; Voltage Rating (DC): 36V
USB1 = USB4105-GF-A: Supplier Part: C3020560; Manufacturer: GCT; Supplier Footprint: SMD; JLCPCB Part Class: Extended Part; Datasheet: https://atta.szlcsc.com/upload/public/pdf/source/20220520/320CE7E4F2C5E8A05ADD2DAC45B818D3.pdf; Supplier: LCSC
CN4 CN5 = HC-2510-2A: Pins Structure:1x2P Pitch:2.54mm Mounting Style:Straight Reference Series:- Number of Pins:2P Number of Rows:1 Number of PINs Per Row:2 Row Spacing:- Current Rating (Max):4A Contact Material:Brass Contact Plating:Tin Operating Temperature Range:-25℃~+85℃; LCSC Part Name: 1x2P 间距:2.54mm 直插; Supplier Part: C2982031; Manufacturer: HCTL(华灿天禄); Supplier Footprint: 插件,P=2.54mm; JLCPCB Part Class: Extended Part; Datasheet: https://atta.szlcsc.com/upload/public/pdf/source/20220311/83CB9A6B67C6DEDDA2AF08A1DCFC516E.pdf; Supplier: LCSC; Pins Structure: 1x2P; Pitch: 2.54mm; Mounting Style: Straight; Number of Pins: 2P; Number of Rows: 1; Number of PINs Per Row: 2; Current Rating (Max): 4A; Contact Material: Brass; Contact Plating: Tin; Operating Temperature Range: -25℃~+85℃
H1 = HDR-M_2.54_1x3P: Supplier Footprint: Through
IC4 IC7 = LMR36015FBRNXT: Supplier Part: C2867810; Manufacturer: TI(德州仪器); Supplier Footprint: VQFN-12(2x3); JLCPCB Part Class: Extended Part; Datasheet: https://www.ti.com/cn/lit/gpn/lmr36015; Supplier: LCSC
L1 = XAL7030-103MEC_
L2 = IHLP2020BZER6R8M01_
LED1 LED2 = LED_0603-G
Q1 Q2 = BC817: Transistor Type: Collector Current (Ic): Collector-Emitter Breakdown Voltage (Vceo): Power Dissipation (Pd): Transition Frequency (fT):100MHz Collector Cut-Off Current (Icbo):100nA Collector-Emitter Saturation Voltage (VCE(sat)@Ic,Ib):700mV@500mA,50mA Ope; LCSC Part Name: NPN 电流:500mA 耐压:45V; Supplier Part: C466643; Manufacturer: High Diode(海德); Supplier Footprint: SOT-23; JLCPCB Part Class: Extended Part; Datasheet: https://atta.szlcsc.com/upload/public/pdf/source/20191203/C466643_48783E87EF98B3225D10B7DDEC5B406B.pdf; Supplier: LCSC; Transition Frequency (fT): 100MHz; Collector Cut-Off Current (Icbo): 100nA; Collector-Emitter Saturation Voltage (VCE(sat)@Ic,Ib): 700mV@500mA,50mA
U3 = HC-VH-2A-TW: Pins Structure:1x2P Pitch:3.96mm Mounting Style:Straight Reference Series:VH Number of Pins:2P Number of Rows:1 Number of PINs Per Row:2 Current Rating (Max):7A Contact Material:Brass Contact Plating:Tin Operating Temperature Range:-25℃~+85℃ Operating Tem; LCSC Part Name: 1x2P 间距:3.96mm 直插 系列:VH; Supplier Part: C19273812; Manufacturer: HC(虹成电子); Supplier Footprint: 插件,P=3.96mm; JLCPCB Part Class: Extended Part; Datasheet: https://atta.szlcsc.com/upload/public/pdf/source/20231201/0B53AF99B5A9DF36C6904573D0FFA4CD.pdf; Supplier: LCSC; Pins Structure: 1x2P; Pitch: 3.96mm; Mounting Style: Straight; Reference Series: VH; Number of Pins: 2P; Number of Rows: 1; Number of PINs Per Row: 2; Current Rating (Max): 7A; Contact Material: Brass; Contact Plating: Tin; Operating Temperature Range: -25℃~+85℃
CON5 = XDFC-0520-40P: Locking Feature:Clamshell Contact Type:Bottom Contact Number of Contacts:40P Pitch:0.5mm Mounting Type:卧贴 FFC, FCB Thickness:0.3mm FFC, FCB Thickness:0.3mm Height Above Board:2mm Contact Material:铜端 Contact Plating:Gold Operating Temperature Range:-40℃~+8; LCSC Part Name: FFC/FPC连接器 PH0.5-40PIN H2.0MM 翻盖式 下接/前翻; Supplier Part: C7527551; Manufacturer: LX(连欣科技); Supplier Footprint: SMD,P=0.5mm; JLCPCB Part Class: Extended Part; Datasheet: https://atta.szlcsc.com/upload/public/pdf/source/20230918/BC9D90A2478B1F11DE066C6B09D8BA06.pdf; Supplier: LCSC; Locking Feature: Clamshell; Contact Type: Bottom Contact; Number of Contacts: 40P; Pitch: 0.5mm; Mounting Type: 卧贴; FFC, FCB Thickness: 0.3mm; Height Above Board: 2mm; Contact Material: 铜端; Contact Plating: Gold; Operating Temperature Range: -40℃~+85℃; Soldering Temperature(Max): 265℃
IC8-IC11 = 74HC165BQ,115: Function: Output Type: Series:; Supplier Part: C426699; Manufacturer: Nexperia(安世); Supplier Footprint: DHVQFN-16-EP(2.5x3.5); JLCPCB Part Class: Extended Part; Datasheet: https://atta.szlcsc.com/upload/public/pdf/source/20191114/C456131_4958C2CF9552F2ACF56B5EE2B7A2605A.pdf; Supplier: LCSC

## Nets
3V3: C20.1 C22.1 C23.1 C30.1 C31.1 C34.1 H1.2 IC1.2(3V3) IC2#2.24(VCC) IC3.3(V+) IC5.8(Vcc) IC6.3(V+) R10.2 R18.2 R19.2 R20.2 R21.2 R22.2 R23.2 R24.2 R25.2 U1.7 U1.8
3V3_LDO_OUT: C28.1 C36.1 H1.1 IC2.2(OUTPUT)
3V3_SWITCHING_OUT: C13.1 C14.1 C17.1 H1.3 L2.2 R7.2
+5V: C15.1 C16.1 C18.1 CON5.2 CON5.3 L1.2 LED3.1(VDD) LED4.1(VDD) LED5.1(VDD) LED6.1(VDD) LED7.1(VDD) LED8.1(VDD) LED9.1(VDD) LED10.1(VDD) LED11.1(VDD) LED12.1(VDD) R8.2
GND: C1.1 C2.2 C3.2 C4.1 C5.1 C6.2 C7.2 C8.1 C11.2 C12.2 C13.2 C14.2 C15.2 C16.2 C19.1 C20.2 C21.1 C22.2 C23.2 C25.2 C26.2 C28.2 C30.2 C31.2 C32.1 C33.1 C34.2 C36.2 CON5.1 CON5.14 CON5.23 CON5.32 IC1.1(GND) IC1.41(GND) IC2.3(GND) IC2#2.1(A0) IC2#2.2(A1) IC2#2.12(GND) IC2#2.21(A2) IC3.2(GND) IC4.1(PGND) IC4.6(AGND) IC4.11(PGND) IC5.4(VEE / GND) IC6.2(GND) IC7.1(PGND) IC7.6(AGND) IC7.11(PGND) IC8.8(GND) IC9.8(GND) IC10.8(GND) IC11.8(GND) LED3.3(GND) LED4.3(GND) LED5.3(GND) LED6.3(GND) LED7.3(GND) LED8.3(GND) LED9.3(GND) LED10.3(GND) LED11.3(GND) LED12.3(GND) Q1.2(E) Q2.2(E) R9.1 R16.1 R17.1 SW1.2(B) SW2.2(B) U1.9 U1.10 U3.2 USB1.1(EH) USB1.A1(GND) USB1.A12(GND) USB1.B1(GND) USB1.B12(GND)
VCC: C1.2 C2.1 C3.1 C4.2 C5.2 C6.1 C7.1 C8.2 CON5.4 CON5.5 IC4.2(VIN) IC4.9(EN) IC4.10(VIN) IC7.2(VIN) IC7.9(EN) IC7.10(VIN) R2.2 R3.2 U3.1
BOOT_3V3: C10.2 IC4.3(NC) IC4.12(SW) L2.1
BOOT_5V: C9.2 IC7.3(NC) IC7.12(SW) L1.1
DIR1: CON5.6 IC8.11(D0)
DIR2: CON5.7 IC8.12(D1)
DIR3: CON5.8 IC8.13(D2)
DIR4: CON5.9 IC8.14(D3)
DIR5: CON5.10 IC8.3(D4)
DIR6: CON5.11 IC8.4(D5)
DIR7: CON5.12 IC8.5(D6)
DIR8: CON5.13 IC8.6(D7)
DIR9: CON5.15 IC11.11(D0)
DIR10: CON5.16 IC11.12(D1)
DIR11: CON5.17 IC11.13(D2)
DIR12: CON5.18 IC11.14(D3)
DIR13: CON5.19 IC11.3(D4)
DIR14: CON5.20 IC11.4(D5) IC11.5(D6)
DIR15: CON5.21
DIR16: CON5.22 IC11.6(D7)
DIR17: CON5.24 CON5.33 IC9.11(D0) IC10.11(D0)
DIR18: CON5.25 CON5.34 IC9.12(D1) IC10.12(D1)
DIR19: CON5.26 CON5.35 IC9.13(D2) IC10.13(D2)
DIR20: CON5.27 CON5.36 IC9.14(D3) IC10.14(D3)
DIR21: CON5.28 CON5.37 IC9.3(D4) IC10.3(D4)
DIR22: CON5.29 CON5.38 IC9.4(D5) IC10.4(D5)
DIR23: CON5.30 CON5.39 IC9.5(D6) IC10.5(D6)
DIR24: CON5.31 CON5.40 IC9.6(D7) IC10.6(D7)
ESP_BOOT0: C33.2 IC1.27(IO0) SW2.1(A)
ESP_RST: C32.2 IC1.3(EN) R18.1 SW1.1(A)
I2C_RST: IC2#2.3(RESET#) R19.1
I_SENS_1: C19.2 R11.2
I_SENS_2: C21.2 R13.2
I_SENS_2_IN: IC3.4(IN+) IC6.4(IN+) R5.2 R12.2
I_SENS_2_OUT: IC3.5(IN-) IC6.5(IN-) R5.1 R12.1
MIDPOINT_REF: IC3.1(REF) IC5.1(OUTPUT 1) IC5.2(INPUT1(-)) IC6.1(REF)
PG_3V3: IC4.8(PG) Q1.1(B) R4.1
PG_5V: IC7.8(PG) Q2.1(B) R1.1
RGB_DATA: LED3.4(DIN)
SCL: IC1.17(IO9) IC2#2.22(SCL) R24.1
SCL_L: IC2#2.5(SC0) R22.1 U1.3
SCL_R: IC2#2.7(SC1) R23.1 U1.5
SDA: IC1.12(IO8) IC2#2.23(SDA) R25.1
SDA_L: IC2#2.4(SD0) R20.1 U1.4
SDA_R: IC2#2.6(SD1) R21.1 U1.6
USB_D+: USB1.A6(DP1) USB1.B6(DP2)
USB_D-: USB1.A7(DN1) USB1.B7(DN2)
USB_VBUS: C25.1 C26.1 IC2.1(INPUT) USB1.A4(VBUS) USB1.A9(VBUS) USB1.B4(VBUS) USB1.B9(VBUS)
$1N1463: R16.2 USB1.A5(CC1)
$1N1517: R17.2 USB1.B5(CC2)
$2N1656: C11.1 IC7.5(VCC) R1.2
$2N1863: LED1.1(C) Q2.3(C)
$2N1866: LED2.1(C) Q1.3(C)
$2N1869: LED1.2(A) R3.1
$2N2002: C12.1 IC4.5(VCC) R4.2
$2N2029: LED2.2(A) R2.1
$2N3692: C17.2 R7.1 R15.2
$2N3698: C18.2 R8.1 R14.2
$2N4329: IC4.7(FB) R15.1
$2N4335: IC7.7(FB) R14.1
$2N4339: C10.1 IC4.4(BOOT)
$2N4360: C9.1 IC7.4(BOOT)
$3N648: IC5.3(INPUT1(+)) R9.2 R10.1
$3N844: IC3.6(OUT) R11.1
$3N1084: IC6.6(OUT) R13.1
$5N266: LED3.2(DO) LED4.4(DIN)
$5N340: LED4.2(DO) LED5.4(DIN)
$5N414: LED5.2(DO) LED6.4(DIN)
$5N488: LED6.2(DO) LED7.4(DIN)
$5N562: LED7.2(DO) LED8.4(DIN)
$5N636: LED8.2(DO) LED9.4(DIN)
$5N710: LED9.2(DO) LED10.4(DIN)
$5N784: LED10.2(DO) LED11.4(DIN)
$5N858: LED11.2(DO) LED12.4(DIN)

Not connected (* = marked no-connect by the designer): CN4 1 2; CN5 1 2; CON5 41 42; IC1 4(IO4) 5(IO5) 6(IO6) 7(IO7) 8(IO15) 9(IO16) 10(IO17) 11(IO18) 13(IO19) 14(IO20) 15(IO3) 16(IO46) 18(IO10) 19(IO11) 20(IO12) 21(IO13) 22(IO14) 23(IO21) 24(IO33) 25(IO34) 26(IO45) 28(IO35) 29(IO36) 30(IO37) 31(IO38) 32(IO39) 33(IO40) 34(IO41) 35(IO42) 36(RXD0) 37(TXD0) 38(IO2) 39(IO1) 40(GND); IC2#2 8(SD2) 9(SC2) 10(SD3) 11(SC3) 13(SD4) 14(SC4) 15(SD5) 16(SC5) 17(SD6) 18(SC6) 19(SD7) 20(SC7); IC5 5(INPUT2(+) 6(INPUT2(-)) 7(OUTPUT2); IC8 1(PL#) 2(CP) 7(Q7#) 9(Q7) 10(DS) 15(CE#) 16(VCC) 17(PAD); IC9 1(PL#) 2(CP) 7(Q7#) 9(Q7) 10(DS) 15(CE#) 16(VCC) 17(PAD); IC10 1(PL#) 2(CP) 7(Q7#) 9(Q7) 10(DS) 15(CE#) 16(VCC) 17(PAD); IC11 1(PL#) 2(CP) 7(Q7#) 9(Q7) 10(DS) 15(CE#) 16(VCC) 17(PAD); LED12 2(DO); U1 1* 2*; USB1 A8(SBU1)* B8(SBU2)*

## Notes on the sheets
sheet 1
- USB-C
- System buttons
sheet 2
- Power good LEDs
- 3V3 Buck
- Switching frequency 1MHz
- 5V Buck
- Switching frequency 1MHz
- 3V3 Select jumper
sheet 3
- Midpoint reference
- Current sense 1
- Current sense 2

# Board PCB1
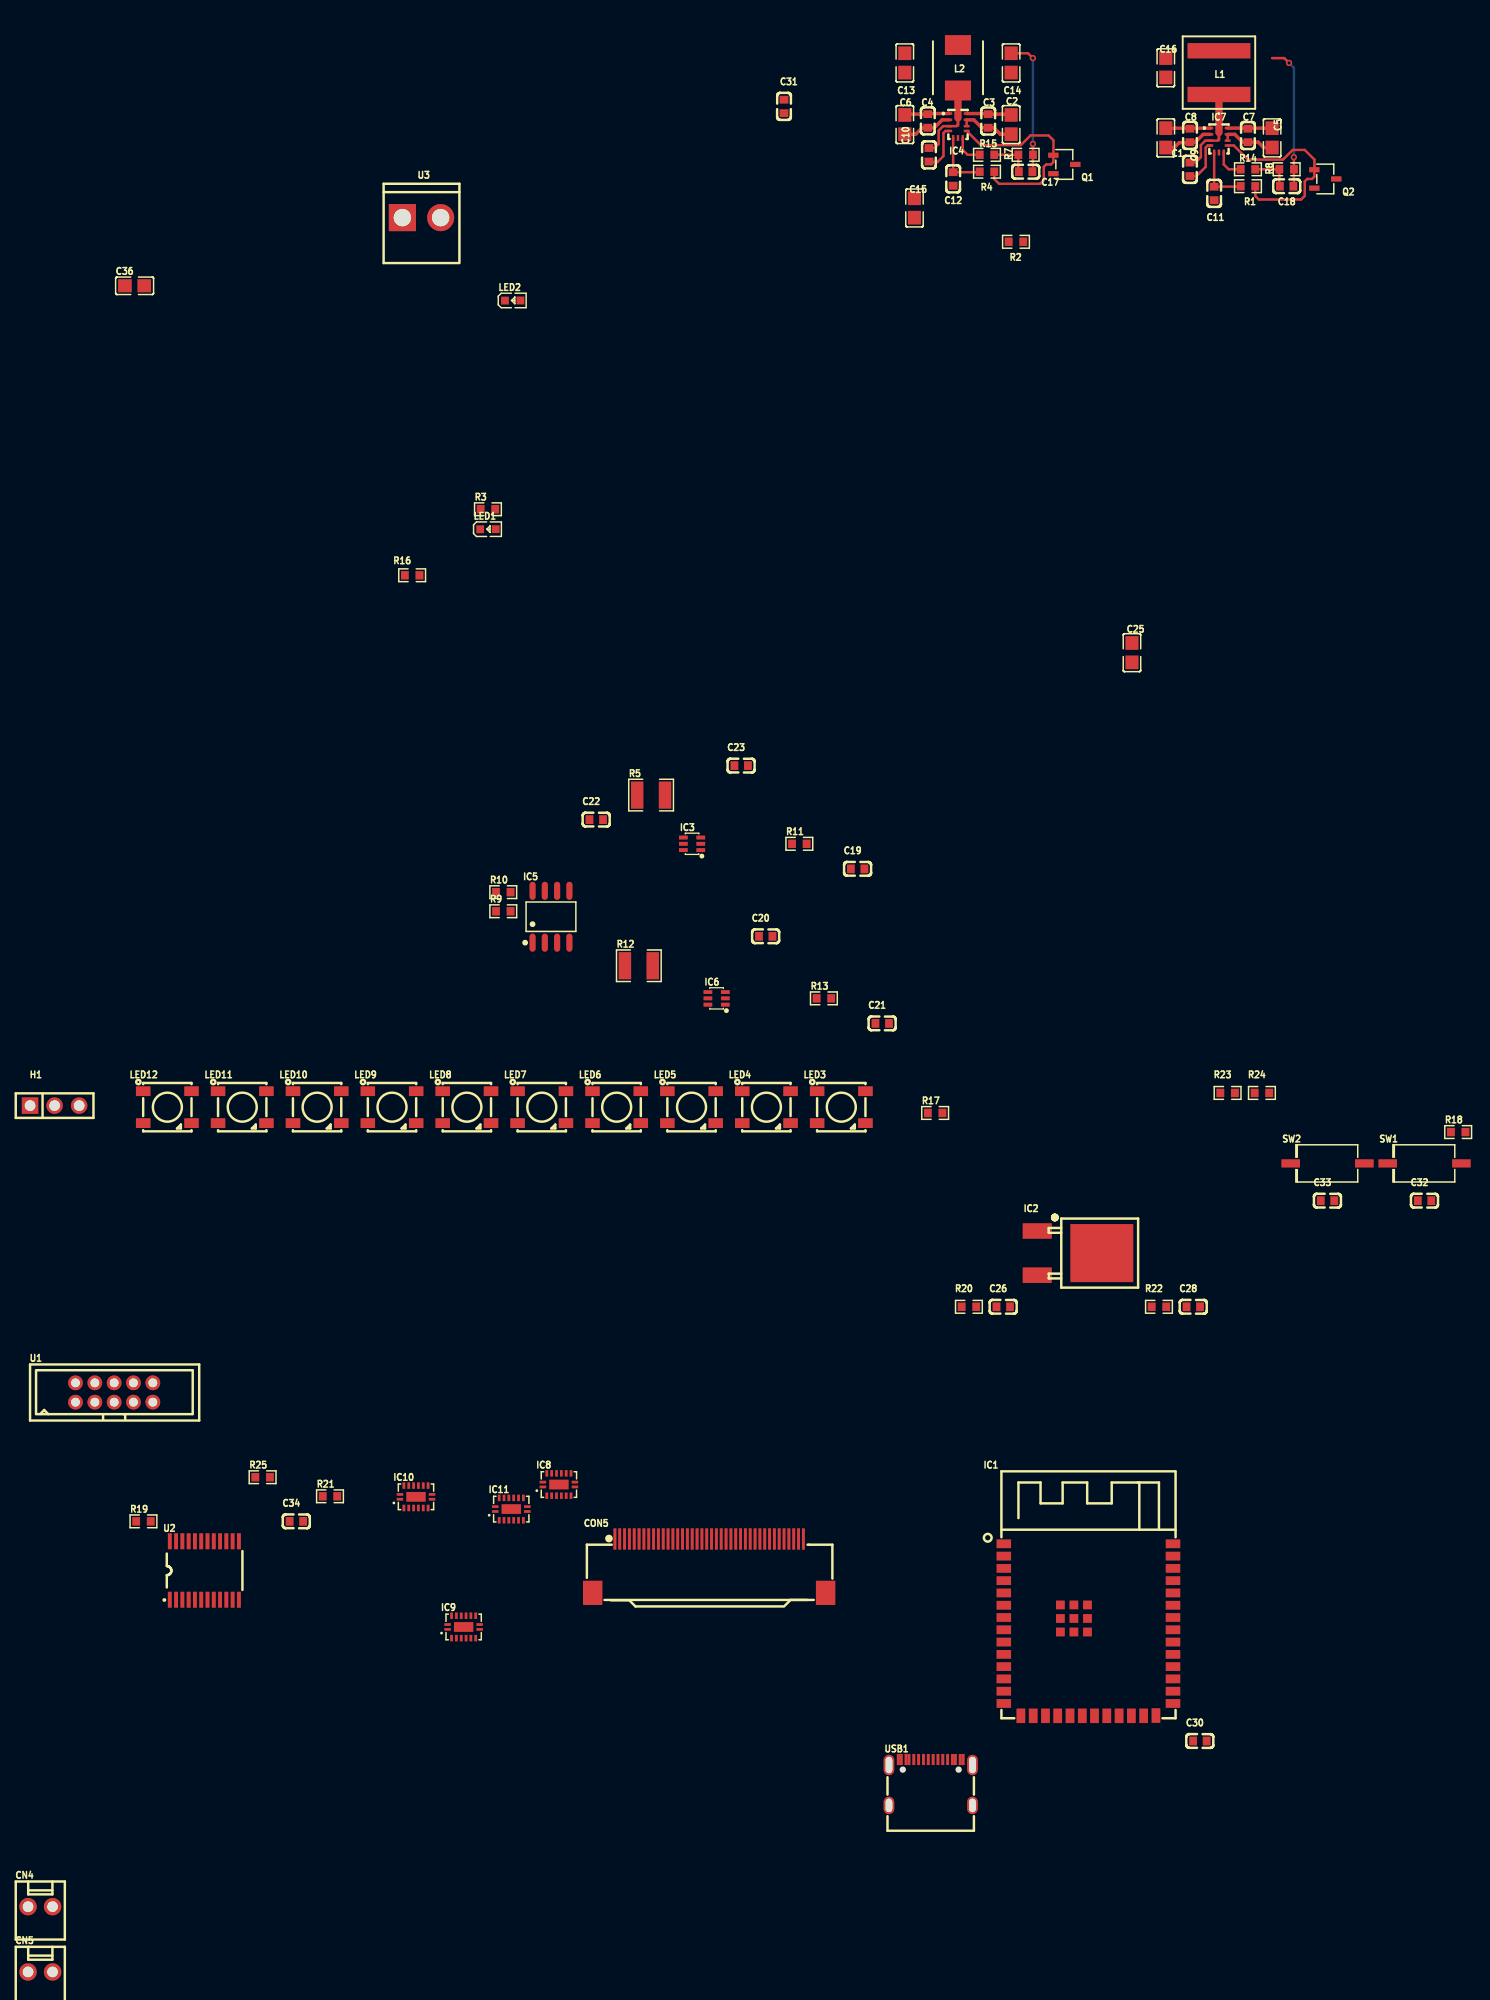
[diagram p7: board, top side]
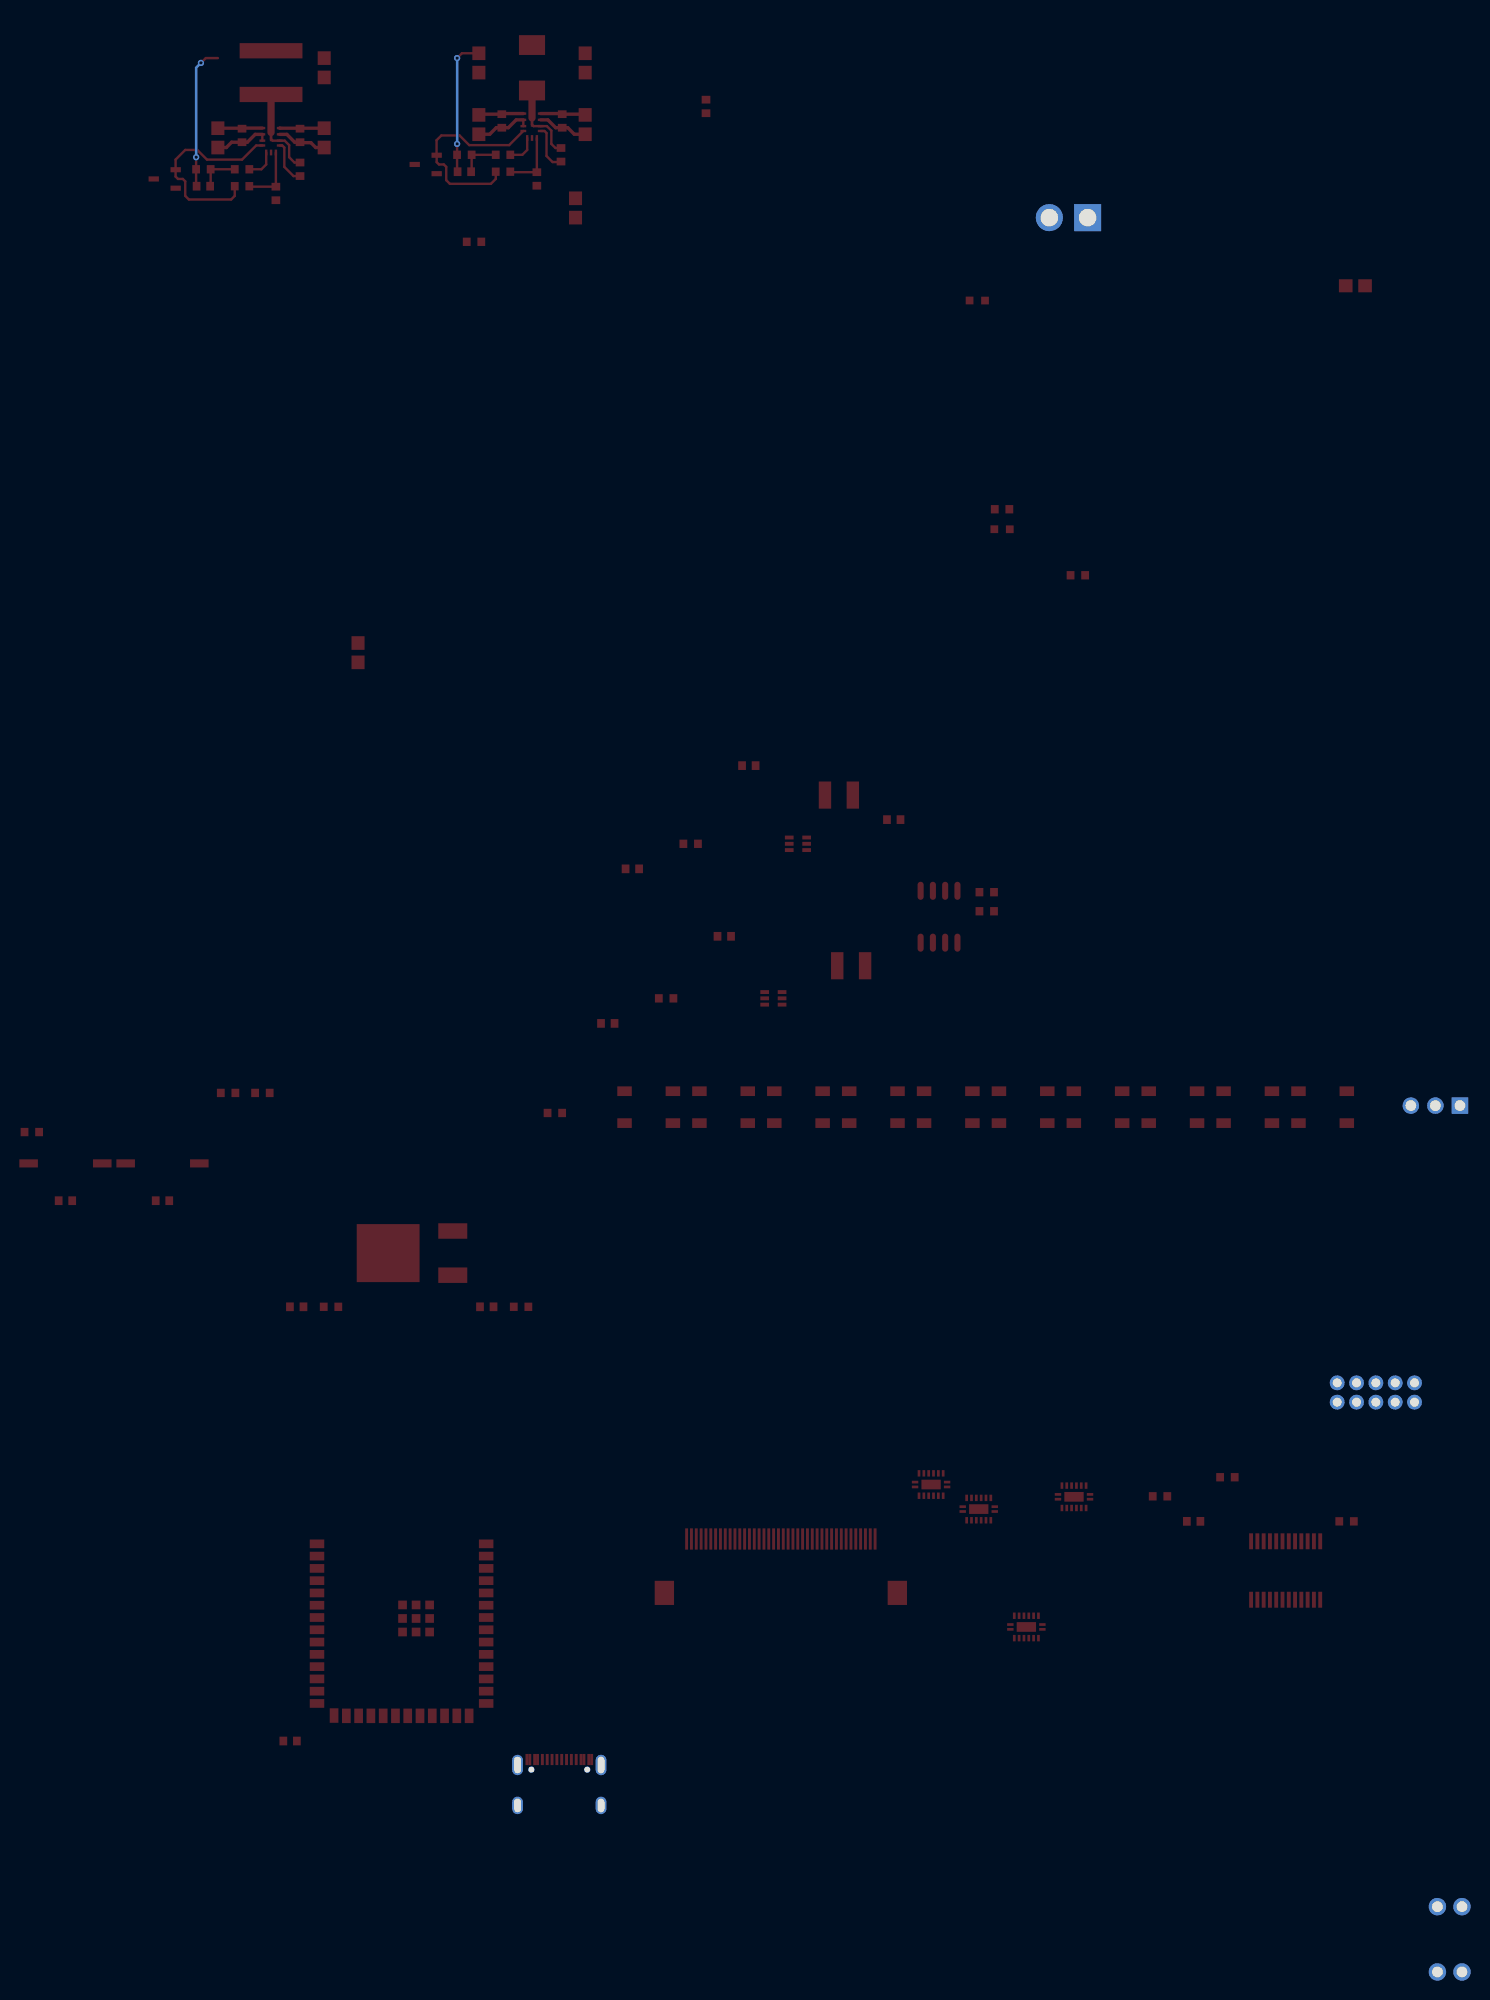
[diagram p8: board, bottom side, seen from below]

Outline 6.42 x 0.64 mm; copper layers: Top Layer, Inner1, Inner2, Bottom Layer. Coordinates in mm from the lower left corner of the outline.
Stack: Top Layer 0.035mm 外层铜厚1oz / Dielectric1 0.2104mm 7628 RC49% 8.6mil / Inner1 0.0152mm 内层铜厚 / Dielectric2 1.065mm 1.1mm H/HOZ 含铜 / Inner2 0.0152mm 内层铜厚 / Dielectric3 0.2104mm 7628 RC49% 8.6mil / Bottom Layer 0.035mm 外层铜厚1oz

## Design rules (mm)
template: Custom Config
spacing copperThickness1oz (default): track to track 0.102, other pairs 0.152 to 0.3
spacing copperThickness2oz: track to track 0.203, other pairs 0.152 to 0.3
track width copperThickness1oz (default): min 0.127, default 0.254, max 2.54
track width copperThickness2oz: min 0.203, default 0.254, max 2.54
differential pair differentialPair (default): width min 0.127, default 0.254, max 2.54; gap min 0.152, default 0.152
via viaSize (default): diameter min 0.5, default 0.61, max 10; hole min 0.3, default 0.305, max 6.3
net +5V uses NoThermals
net 3V3_SWITCHING_OUT uses NoThermals

## Placement (name value [footprint] x y rotation side)
C1  22uF  [C0805]  27.53 169.1 270 top
C2  22uF  [C0805]  11.53 170.48 90 top
C3  220nF  [C0603]  9.16 170.85 90 top
C4  220nF  [C0603]  2.91 170.85 270 top
C5  22uF  [C0805]  38.53 169.1 270 top
C6  22uF  [C0805]  0.53 170.48 90 top
C7  220nF  [C0603]  36.03 169.35 90 top
C8  220nF  [C0603]  30.03 169.35 270 top
C9  100nF  [C0603]  30.03 165.85 90 top
C10  100nF  [C0603]  3.03 167.35 90 top
C11  1uF  [C0603]  32.53 163.35 270 top
C12  1uF  [C0603]  5.53 164.85 270 top
C13  22uF  [C0805]  0.53 176.85 270 top
C14  22uF  [C0805]  11.53 176.85 270 top
C15  22uF  [C0805]  1.53 161.85 90 top
C16  22uF  [C0805]  27.53 176.35 270 top
C17  20pF  [C0603]  13.03 165.6 180 top
C18  20pF  [C0603]  40.03 164.1 180 top
C19  100nF  [C0603]  -4.35 93.49 0 top
C20  100nF  [C0603]  -13.86 86.52 0 top
C21  100nF  [C0603]  -1.81 77.51 0 top
C22  100nF  [C0603]  -31.39 98.58 0 top
C23  100nF  [C0603]  -16.4 104.17 0 top
C25  22uF  [C0805]  24.03 115.85 90 top
C26  100nF  [C0603]  10.72 48.19 0 top
C28  100nF  [C0603]  30.38 48.19 0 top
C30  1uF  [C0603]  31.06 3.28 0 top
C31  1uF  [C0603]  -11.97 172.35 270 top
C32  100nF  [C0603]  54.3 59.17 0 top
C33  100nF  [C0603]  44.26 59.17 0 top
C34  100nF  [C0603]  -62.41 26 0 top
C36  22uF  [C0805]  -79.15 153.8 0 top
CN4  HC-2510-2A  [CONN-TH_2P-P2.54_HCTL_HC-2510-2A]  -88.91 -13.85 0 top
CN5  HC-2510-2A  [CONN-TH_2P-P2.54_HCTL_HC-2510-2A]  -88.91 -20.61 0 top
CON5  XDFC-0520-40P  [conn-smd_40p-p0.50_f31l-1a7h1-21040]  -19.71 21.39 0 top
H1  -  [HDR-TH_3P-P2.54-V-M]  -87.43 69 0 top
IC1  2.4GHz  [WIRELM-SMD_ESP32-S3-WROOM-1]  19.53 14.78 0 top
IC2  LF33CDT-TRY  [TO-252-3_L6.6-W6.1-P4.56-LS9.9-TL]  17.57 53.75 0 top
IC3  INA199A3DCKR  [SOT-363_L2.0-W1.3-P0.65-LS2.1-BR]  -21.48 96.08 0 top
IC4  LMR36015FBRNXT  [VQFN-12_L3.0-W2.0-P0.65-BL_TI_RNX]  6.03 170.35 270 top
IC5  LM358  [SOP-8_L4.9-W3.9-P1.27-LS6.0-BL]  -36.07 88.54 0 top
IC6  INA199A3DCKR  [SOT-363_L2.0-W1.3-P0.65-LS2.1-BR]  -18.94 80.1 0 top
IC7  LMR36015FBRNXT  [VQFN-12_L3.0-W2.0-P0.65-BL_TI_RNX]  33.03 168.85 270 top
IC8  74HC165BQ,115  [DHVQFN-16_L3.5-W2.5-P0.50-BL-EP]  -35.25 29.81 0 top
IC9  74HC165BQ,115  [DHVQFN-16_L3.5-W2.5-P0.50-BL-EP]  -45.11 15.08 0 top
IC10  74HC165BQ,115  [DHVQFN-16_L3.5-W2.5-P0.50-BL-EP]  -50.04 28.54 0 top
IC11  74HC165BQ,115  [DHVQFN-16_L3.5-W2.5-P0.50-BL-EP]  -40.18 27.27 0 top
L1  10uH  [XAL7030103MEC]  33.03 175.85 90 top
L2  6.8uH  [INDPM5552X200N]  6.03 176.35 90 top
LED1  -  [LED0603-RD_GREEN]  -42.59 128.62 0 top
LED2  -  [LED0603-RD_GREEN]  -40.03 152.28 0 top
LED3  5050  [LED-SMD_4P-L5.0-W5.0-BL_TC5050RGB]  -6.04 68.84 0 top
LED4  5050  [LED-SMD_4P-L5.0-W5.0-BL_TC5050RGB]  -13.79 68.84 0 top
LED5  5050  [LED-SMD_4P-L5.0-W5.0-BL_TC5050RGB]  -21.53 68.84 0 top
LED6  5050  [LED-SMD_4P-L5.0-W5.0-BL_TC5050RGB]  -29.28 68.84 0 top
LED7  5050  [LED-SMD_4P-L5.0-W5.0-BL_TC5050RGB]  -37.03 68.84 0 top
LED8  5050  [LED-SMD_4P-L5.0-W5.0-BL_TC5050RGB]  -44.77 68.84 0 top
LED9  5050  [LED-SMD_4P-L5.0-W5.0-BL_TC5050RGB]  -52.52 68.84 0 top
LED10  5050  [LED-SMD_4P-L5.0-W5.0-BL_TC5050RGB]  -60.27 68.84 0 top
LED11  5050  [LED-SMD_4P-L5.0-W5.0-BL_TC5050RGB]  -68.01 68.84 0 top
LED12  5050  [LED-SMD_4P-L5.0-W5.0-BL_TC5050RGB]  -75.76 68.84 0 top
Q1  BC817  [SOT-23-3_L2.9-W1.4-P1.91-LS2.6-BR]  17.03 166.35 180 top
Q2  BC817  [SOT-23-3_L2.9-W1.4-P1.91-LS2.6-BR]  44.03 164.85 180 top
R1  100K  [R0603]  36.03 164.1 180 top
R2  10K  [R0603]  12.03 158.35 0 top
R3  10K  [R0603]  -42.59 130.69 0 top
R4  100K  [R0603]  9.03 165.6 180 top
R5  0.02Ω-1210  [R1210]  -25.71 101.12 0 top
R7  100k  [R0603]  13.03 167.35 0 top
R8  100k  [R0603]  40.03 165.85 0 top
R9  10kΩ  [R0603]  -41.01 89.11 0 top
R10  10kΩ  [R0603]  -41.01 91.08 0 top
R11  1K  [R0603]  -10.38 96.08 0 top
R12  0.02Ω-1210  [R1210]  -26.98 83.47 0 top
R13  1K  [R0603]  -7.84 80.1 0 top
R14  24k9  [R0603]  36.03 165.85 0 top
R15  43k2  [R0603]  9.03 167.35 0 top
R16  5k1  [R0603]  -50.44 123.86 0 top
R17  5k1  [R0603]  3.67 68.24 0 top
R18  10K  [R0603]  57.78 66.27 0 top
R19  10K  [R0603]  -78.23 26 0 top
R20  5k1  [R0603]  7.17 48.19 0 top
R21  5k1  [R0603]  -58.94 28.59 0 top
R22  5k1  [R0603]  26.83 48.19 0 top
R23  5k1  [R0603]  33.93 70.32 0 top
R24  5k1  [R0603]  37.48 70.32 0 top
R25  5k1  [R0603]  -65.91 30.57 0 top
SW1  TS3625A-HT  [SW-SMD_L6.1-W3.7-LS7.9]  54.3 63.03 0 top
SW2  TS3625A-HT  [SW-SMD_L6.1-W3.7-LS7.9]  44.26 63.03 0 top
U1  DIP_2*5PIN_80MIL  [IDC-TH_10P-P2.00_C9900022934]  -81.27 39.33 0 top
U2  PCA9548APWR  [TSSOP-24_L7.8-W4.4-P0.65-LS6.4-BL]  -71.93 20.92 0 top
U3  HC-VH-2A-TW  [CONN-TH_2P-P3.96_HC-VH-2A-TW]  -49.47 160.85 0 top
USB1  USB4105-GF-A  [TYPE-C-SMD_SBC-160S1A-20-S412]  3.21 -1 0 top

## Footprints (pads in the part's own frame, mm; a bottom-side part is the same pattern mirrored in y, then rotated)
C0603
  rect 0.8x0.9 smd: 1(-0.7,0) 2(0.7,0)
C0805
  rect 1.41x1.35 smd: 1(-1,0) 2(1,0)
conn-smd_40p-p0.50_f31l-1a7h1-21040
  rect 0.3x2.2 smd: 1(-9.75,2.788) 2(-9.25,2.788) 3(-8.75,2.788) 4(-8.25,2.788) 5(-7.75,2.788) 6(-7.25,2.788) 7(-6.75,2.788) 8(-6.25,2.788) 9(-5.75,2.788) 10(-5.25,2.788) 11(-4.75,2.788) 12(-4.25,2.788) 13(-3.75,2.788) 14(-3.25,2.788) 15(-2.75,2.788) 16(-2.25,2.788) 17(-1.75,2.788) 18(-1.25,2.788) 19(-0.75,2.788) 20(-0.25,2.788) 21(0.25,2.788) 22(0.75,2.788) 23(1.25,2.788) 24(1.75,2.788) 25(2.25,2.788) 26(2.75,2.788) 27(3.25,2.788) 28(3.75,2.788) 29(4.25,2.788) 30(4.75,2.788) 31(5.25,2.788) 32(5.75,2.788) 33(6.25,2.788) 34(6.75,2.788) 35(7.25,2.788) 36(7.75,2.788) 37(8.25,2.788) 38(8.75,2.788) 39(9.25,2.788) 40(9.75,2.788)
  rect 2x2.5 smd: 41(-12.05,-2.788) 42(12.05,-2.788)
CONN-TH_2P-P2.54_HCTL_HC-2510-2A
  round 1.8 hole 1.1: 1(-1.27,0) 2(1.27,0)
CONN-TH_2P-P3.96_HC-VH-2A-TW
  rect 2.8x2.8 hole 1.8: 1(-1.98,0)
  round 2.8 hole 1.8: 2(1.98,0)
DHVQFN-16_L3.5-W2.5-P0.50-BL-EP
  rect 0.665x0.28 smd: 1(-1.657,-0.25) 8(1.657,-0.25) 9(1.657,0.25) 16(-1.657,0.25)
  rect 0.28x0.665 smd: 2(-1.25,-1.157) 3(-0.75,-1.157) 4(-0.25,-1.157) 5(0.25,-1.157) 6(0.75,-1.157) 7(1.25,-1.157) 10(1.25,1.157) 11(0.75,1.157) 12(0.25,1.157) 13(-0.25,1.157) 14(-0.75,1.157) 15(-1.25,1.157)
  rect 2x1 smd: 17(0,0)
HDR-TH_3P-P2.54-V-M
  rect 1.7x1.7 hole 1.1: 1(-2.54,0)
  round 1.7 hole 1.1: 2(0,0) 3(2.54,0)
IDC-TH_10P-P2.00_C9900022934
  round 1.524 hole 0.914: 1(-4.002,-1) 2(-4.002,1) 3(-2.001,-1) 4(-2.001,1) 5(-0.002,-1) 6(-0.002,1) 7(1.998,-1) 8(1.998,1) 9(4.002,-1) 10(4.002,1)
INDPM5552X200N
  rect 2.05x2.7 smd: 1(-2.35,0) 2(2.35,0)
LED0603-RD_GREEN
  rect 0.8x0.8 smd: 1(-0.799,-0.004) 2(0.799,0.004)
LED-SMD_4P-L5.0-W5.0-BL_TC5050RGB
  rect 1.5x1 smd: 1(-2.5,1.65) 2(-2.5,-1.65) 3(2.5,-1.65) 4(2.5,1.65)
R0603
  rect 0.806x0.864 smd: 1(-0.753,0) 2(0.753,0)
R1210
  rect 1.282x2.808 smd: 1(-1.441,0) 2(1.441,0)
SOP-8_L4.9-W3.9-P1.27-LS6.0-BL
  oval 0.63x1.865 smd: 1(-1.905,-2.683) 2(-0.635,-2.683) 3(0.635,-2.683) 4(1.905,-2.683) 5(1.905,2.683) 6(0.635,2.683) 7(-0.635,2.683) 8(-1.905,2.683)
SOT-23-3_L2.9-W1.4-P1.91-LS2.6-BR
  rect 1.07x0.532 smd: 1(1.135,-0.955) 2(1.135,0.955) 3(-1.135,0)
SOT-363_L2.0-W1.3-P0.65-LS2.1-BR
  rect 0.9x0.4 smd: 1(0.9,-0.65) 2(0.9,0) 3(0.9,0.65) 4(-0.9,0.65) 5(-0.9,0) 6(-0.9,-0.65)
SW-SMD_L6.1-W3.7-LS7.9
  rect 1.92x0.84 smd: 1(3.81,0) 2(-3.81,0)
TO-252-3_L6.6-W6.1-P4.56-LS9.9-TL
  rect 3x1.6 smd: 1(-3.342,2.285) 2(-3.342,-2.285)
  rect 6.5x6 smd: 3(3.342,0)
TSSOP-24_L7.8-W4.4-P0.65-LS6.4-BL
  rect 0.4x1.65 smd: 1(-3.575,-3.022) 2(-2.925,-3.022) 3(-2.275,-3.022) 4(-1.625,-3.022) 5(-0.975,-3.022) 6(-0.325,-3.022) 7(0.325,-3.022) 8(0.975,-3.022) 9(1.625,-3.022) 10(2.275,-3.022) 11(2.925,-3.022) 12(3.575,-3.022) 13(3.575,3.022) 14(2.925,3.022) 15(2.275,3.022) 16(1.625,3.022) 17(0.975,3.022) 18(0.325,3.022) 19(-0.325,3.022) 20(-0.975,3.022) 21(-1.625,3.022) 22(-2.275,3.022) 23(-2.925,3.022) 24(-3.575,3.022)
TYPE-C-SMD_SBC-160S1A-20-S412
  oval 1.1x2.1 hole 0.7x1.7: 1(-4.32,1.807) 1(4.32,1.807)
  oval 1.1x1.8 hole 0.7x1.4: 1(-4.32,-2.373) 1(4.32,-2.373)
  rect 0.3x1.15 smd: A1(-3.35,2.372) A4(-2.55,2.372) A5(-1.25,2.372) A6(-0.25,2.372) A7(0.25,2.372) A8(1.25,2.373) A9(2.55,2.373) A12(3.35,2.372) B1(3.05,2.372) B4(2.25,2.373) B5(1.75,2.372) B6(0.75,2.372) B7(-0.75,2.372) B8(-1.75,2.373) B9(-2.25,2.372) B12(-3.05,2.372)
VQFN-12_L3.0-W2.0-P0.65-BL_TI_RNX
  rect 0.25x0.6 smd: 1(-1.262,-0.9) 2(-0.613,-0.9) 3(0.037,-0.9) 4(0.537,-0.9) 8(0.537,0.9) 9(0.037,0.9) 10(-0.613,0.9) 11(-1.262,0.9)
  rect 0.6x0.25 smd: 5(1.262,-0.5) 6(1.262,0) 7(1.262,0.5)
  rect 1.825x0.25 smd: 12(-0.812,0)
WIRELM-SMD_ESP32-S3-WROOM-1
  rect 1.5x0.9 smd: 1(-8.75,8.895) 2(-8.75,7.625) 3(-8.75,6.355) 4(-8.75,5.085) 5(-8.75,3.815) 6(-8.75,2.545) 7(-8.75,1.275) 8(-8.75,0.005) 9(-8.75,-1.265) 10(-8.75,-2.535) 11(-8.75,-3.805) 12(-8.75,-5.075) 13(-8.75,-6.345) 14(-8.75,-7.615) 27(8.75,-7.615) 28(8.75,-6.345) 29(8.75,-5.075) 30(8.75,-3.805) 31(8.75,-2.535) 32(8.75,-1.265) 33(8.75,0.005) 34(8.75,1.275) 35(8.75,2.545) 36(8.75,3.815) 37(8.75,5.085) 38(8.75,6.355) 39(8.75,7.625) 40(8.75,8.895)
  rect 0.9x1.5 smd: 15(-6.985,-8.895) 16(-5.715,-8.895) 17(-4.445,-8.895) 18(-3.175,-8.895) 19(-1.905,-8.895) 20(-0.635,-8.895) 21(0.635,-8.895) 22(1.905,-8.895) 23(3.175,-8.895) 24(4.445,-8.895) 25(5.715,-8.895) 26(6.985,-8.865)
  rect 0.9x0.9 smd: 41(-2.9,2.575) 41(-2.9,1.175) 41(-2.9,-0.225) 41(-1.5,2.575) 41(-1.5,1.175) 41(-1.5,-0.225) 41(-0.1,2.575) 41(-0.1,1.175) 41(-0.1,-0.225)
XAL7030103MEC
  rect 1.58x6.5 smd: 1(-2.26,0) 2(2.26,0)

## Nets
As in the schematic, except:
3V3: C20.1 C22.1 C23.1 C30.1 C31.1 C34.1 H1.2 IC1.2 IC3.3 IC5.8 IC6.3 R10.2 R18.2 R19.2 R20.2 R21.2 R22.2 R23.2 R24.2 R25.2 U1.7 U1.8 U2.24
GND: C1.1 C2.2 C3.2 C4.1 C5.1 C6.2 C7.2 C8.1 C11.2 C12.2 C13.2 C14.2 C15.2 C16.2 C19.1 C20.2 C21.1 C22.2 C23.2 C25.2 C26.2 C28.2 C30.2 C31.2 C32.1 C33.1 C34.2 C36.2 CON5.1 CON5.14 CON5.23 CON5.32 IC1.1 IC1.41 IC2.3 IC3.2 IC4.1 IC4.6 IC4.11 IC5.4 IC6.2 IC7.1 IC7.6 IC7.11 IC8.8 IC9.8 IC10.8 IC11.8 LED3.3 LED4.3 LED5.3 LED6.3 LED7.3 LED8.3 LED9.3 LED10.3 LED11.3 LED12.3 Q1.2 Q2.2 R9.1 R16.1 R17.1 SW1.2 SW2.2 U1.9 U1.10 U2.1 U2.2 U2.12 U2.21 USB1.1 USB1.A1 USB1.A12 USB1.B1 USB1.B12
VCC: C1.2 C2.1 C3.1 C4.2 C5.2 C6.1 C7.1 C8.2 CON5.4 CON5.5 IC4.2 IC4.9 IC4.10 IC7.2 IC7.9 IC7.10 R2.2 R3.2
I2C_RST: R19.1 U2.3
SCL: IC1.17 R24.1 U2.22
SCL_L: R22.1 U1.3 U2.5
SCL_R: R23.1 U1.5 U2.7
SDA: IC1.12 R25.1 U2.23
SDA_L: R20.1 U1.4 U2.4
SDA_R: R21.1 U1.6 U2.6

Pads without a net: CN4 1 2; CN5 1 2; CON5 41 42; IC1 4 5 6 7 8 9 10 11 13 14 15 16 18 19 20 21 22 23 24 25 26 28 29 30 31 32 33 34 35 36 37 38 39 40; IC5 5 6 7; IC8 1 2 7 9 10 15 16 17; IC9 1 2 7 9 10 15 16 17; IC10 1 2 7 9 10 15 16 17; IC11 1 2 7 9 10 15 16 17; U1 1 2; U2 8 9 10 11 13 14 15 16 17 18 19 20; U3 1 2; USB1 A8 B8

## Via types
v1: diameter 0.65, hole 0.35, Top Layer to Bottom Layer, 4 vias

## Routing (per net, layer and track width the routed paths; a pad name or vN(x,y) marks a point on that pad's centre or on a via; arc(x,y) is an arc through that point)
3V3_SWITCHING_OUT: length 14.2
  Top Layer w0.25: v1(13.78,168.48) 13.79,168.47 R7.2 13.79,165.65 C17.1 ; C14.1 13.28,177.85 v1(13.78,177.35)
  Bottom Layer w0.25: v1(13.78,177.35) v1(13.78,168.48)
+5V: length 15.2
  Top Layer w0.25: v1(40.28,176.85) 39.78,177.35 38.53,177.35 ; v1(40.78,167.1) 40.78,165.85 R8.2 40.79,163.91 40.73,163.85
  Bottom Layer w0.25: v1(40.78,167.1) 40.78,176.35 v1(40.28,176.85)
GND: length 18.5
  Top Layer w0.35: IC7.1 32.12,170.1 29.98,170.1 ; IC7.11 35.97,170.11 C7.2 36.08,170.1 C5.1 ; IC4.1 2.97,171.61 C4.1 0.61,171.55 C6.2 ; IC4.11 9.1,171.61 C3.2 11.33,171.55 11.41,171.48 ; 29.98,170.1 C8.1 ; 29.98,170.1 C1.1
VCC: length 22.1
  Top Layer w0.25: IC4.9 IC4.10 ; IC7.10 IC7.9
  Top Layer w0.35: C1.2 28.41,168.1 28.91,168.6 29.98,168.6 C8.2 30.58,168.65 31.4,169.46 IC7.2 ; IC4.10 7.67,170.96 8.48,170.15 C3.1 9.73,170.15 10.41,169.48 11.41,169.48 11.53,169.6 ; C5.2 37.66,168.1 37.11,168.65 C7.1 35.48,168.65 34.67,169.46 IC7.10 ; IC4.2 4.4,170.96 3.58,170.15 C4.2 2.33,170.15 1.66,169.48 C6.1
BOOT_3V3: length 8.3
  Top Layer w0.25: IC4.12 6.03,170.48 5.87,170.31 IC4.3 4.5,170.31 4.03,169.85 4.03,168.48 3.61,168.05 C10.2
  Top Layer w0.75: IC4.12 L2.1
BOOT_5V: length 9.4
  Top Layer w0.25: IC7.12 33.03,168.98 32.87,168.81 IC7.3 31.62,168.81 31.16,168.35 31.16,167.1 30.61,166.55 C9.2
  Top Layer w0.75: IC7.12 L1.1
PG_3V3: length 21.3
  Top Layer w0.25: R4.1 9.78,165.6 9.78,164.85 10.28,164.35 14.53,164.35 14.91,164.73 14.91,166.1 15.16,166.35 15.66,166.35 15.9,166.59 Q1.1 15.91,167.32 15.91,168.85 15.41,169.35 13.53,169.35 12.53,168.35 8.4,168.35 IC4.8
PG_5V: length 21.3
  Top Layer w0.25: IC7.8 34.57,168.31 36.03,166.85 39.66,166.85 40.66,167.85 41.91,167.85 42.91,166.85 42.91,165.82 Q2.1 42.91,165.8 42.91,165.1 42.66,164.85 42.16,164.85 41.91,164.6 41.91,163.1 41.53,162.73 37.16,162.73 36.79,163.1 R1.1
$2N1656: length 6.3
  Top Layer w0.25: IC7.5 C11.1 35.23,164.05 R1.2
$2N2002: length 6.3
  Top Layer w0.25: R4.2 8.23,165.55 C12.1 IC4.5
$2N3692: length 4.3
  Top Layer w0.25: R15.2 R7.1 12.28,165.66 C17.2
$2N3698: length 4.5
  Top Layer w0.25: 39.33,163.85 39.28,163.91 R8.1 R14.2
$2N4329: length 3.2
  Top Layer w0.25: IC4.7 6.53,167.85 7.03,167.35 R15.1
$2N4335: length 3.2
  Top Layer w0.25: R14.1 34.03,165.85 33.53,166.35 IC7.7
$2N4339: length 4.8
  Top Layer w0.25: IC4.4 4.75,169.81 4.53,169.6 4.53,167.23 3.91,166.6 3.08,166.6 C10.1
$2N4360: length 4.6
  Top Layer w0.25: IC7.4 31.87,168.31 31.66,168.1 31.66,166.1 30.71,165.15 C9.1

## Copper pours and planes (outline as drawn; the poured copper is in the pictures)
3V3_SWITCHING_OUT on Top Layer: -0.22,177.1 2.28,177.1 3.03,176.35 9.03,176.35 9.78,177.1 12.28,177.1 13.03,177.85 13.03,179.85 12.53,180.35 -0.47,180.35 -0.97,179.85 -0.97,177.85
+5V on Top Layer: 28.53,176.6 29.28,175.85 36.78,175.85 37.53,176.6 39.28,176.6 39.53,176.85 39.53,179.35 39.03,179.85 27.03,179.85 26.53,179.35 26.53,176.85 26.78,176.6
